# Altium project ANAlOG_MEZZANINE1.01.PrjPcb
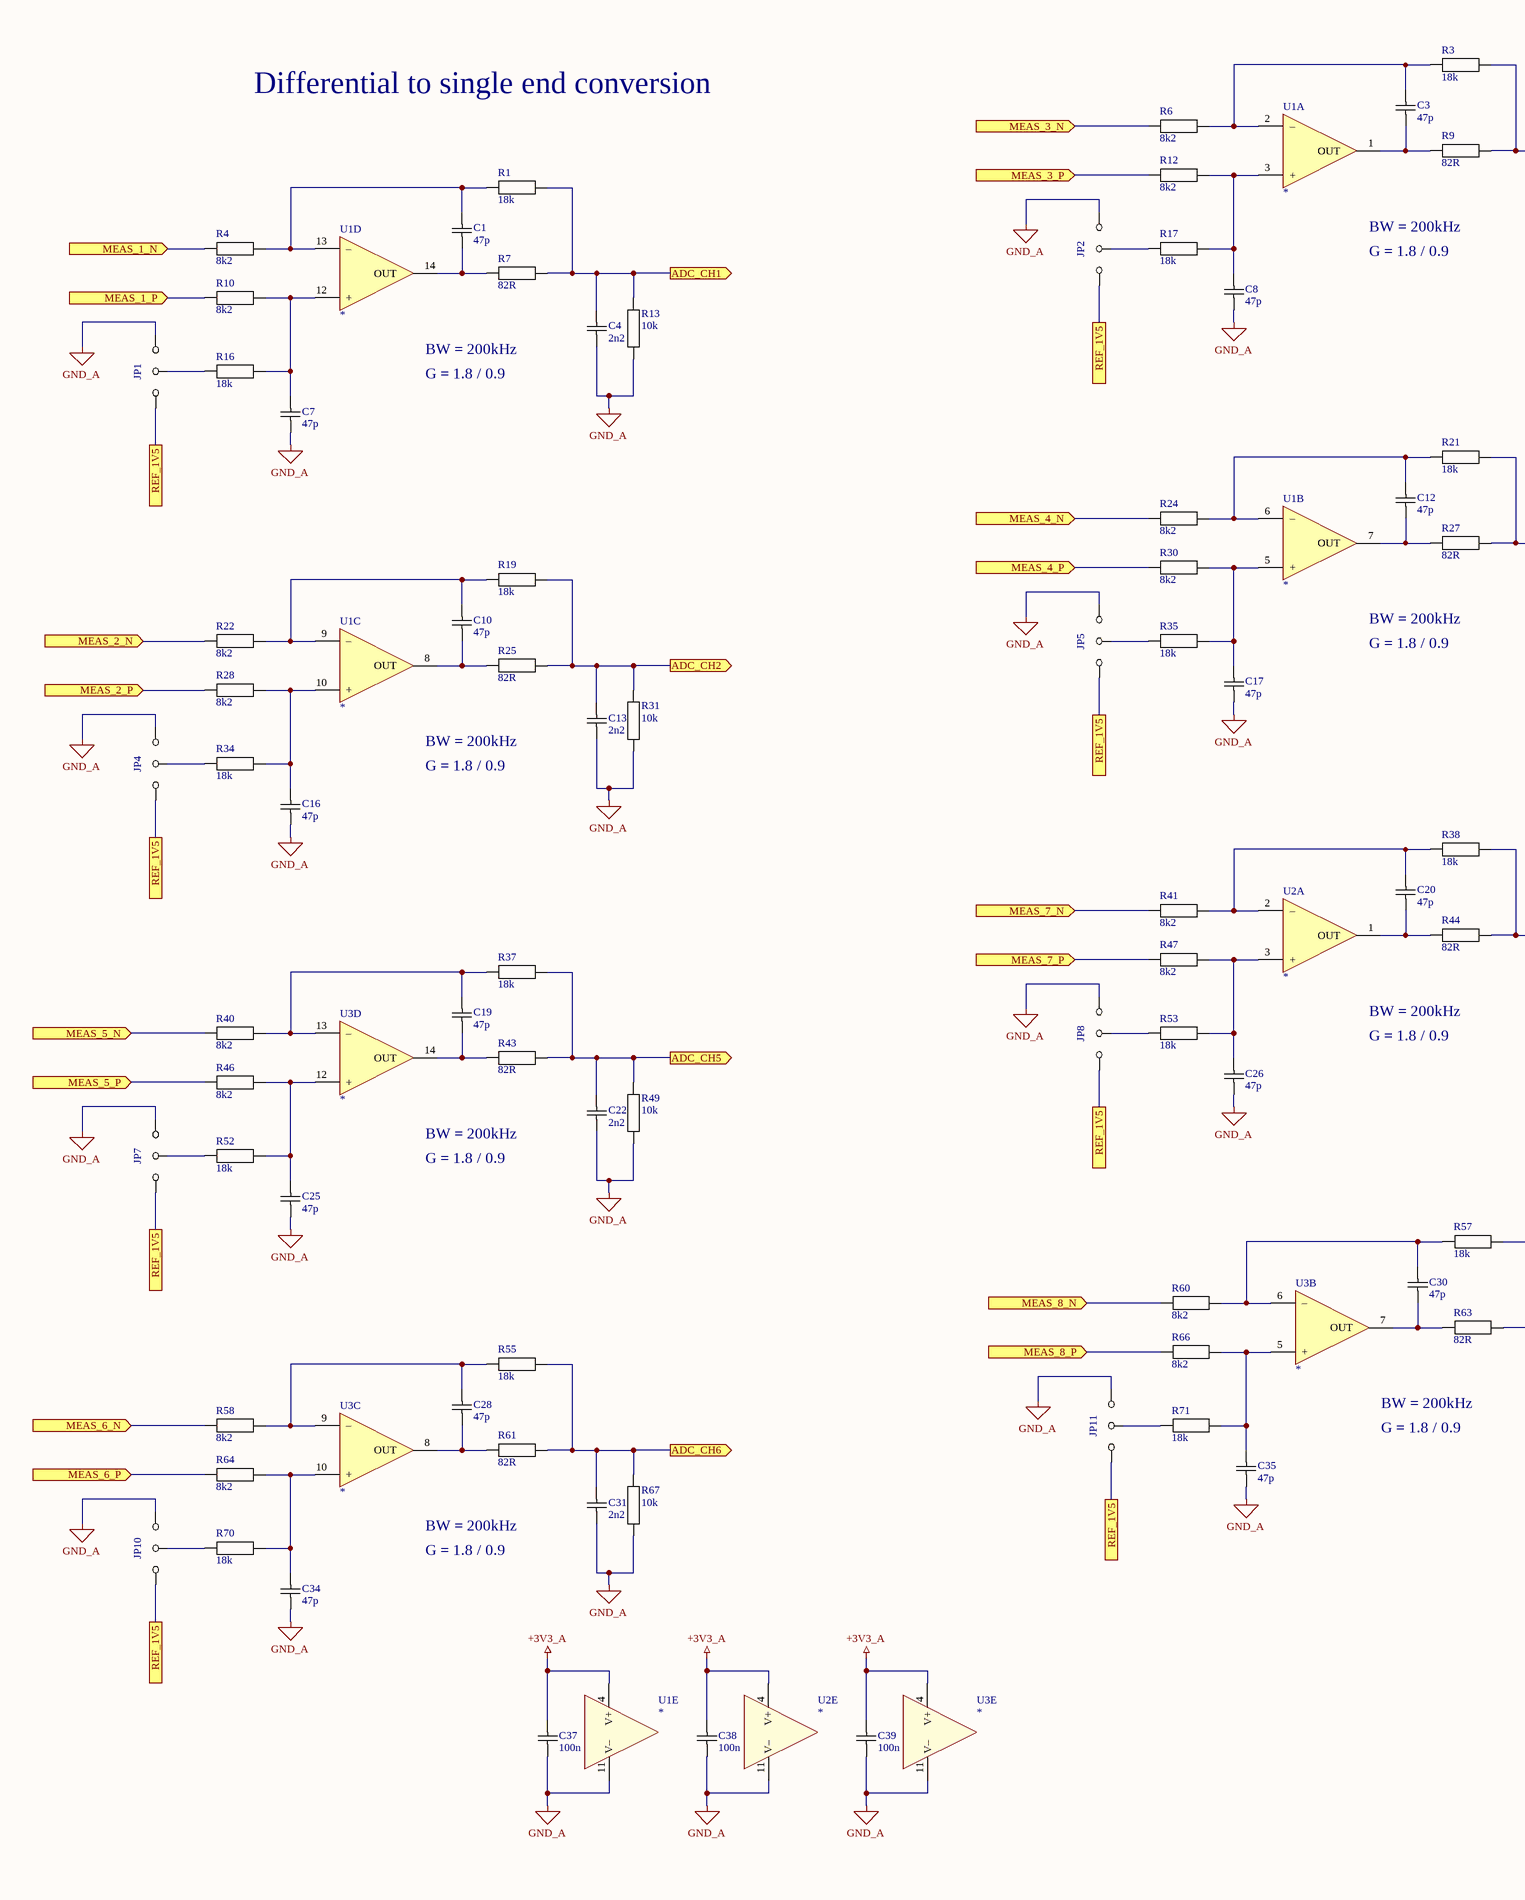
[diagram p0: AD_0_V1_01.SchDoc, left]
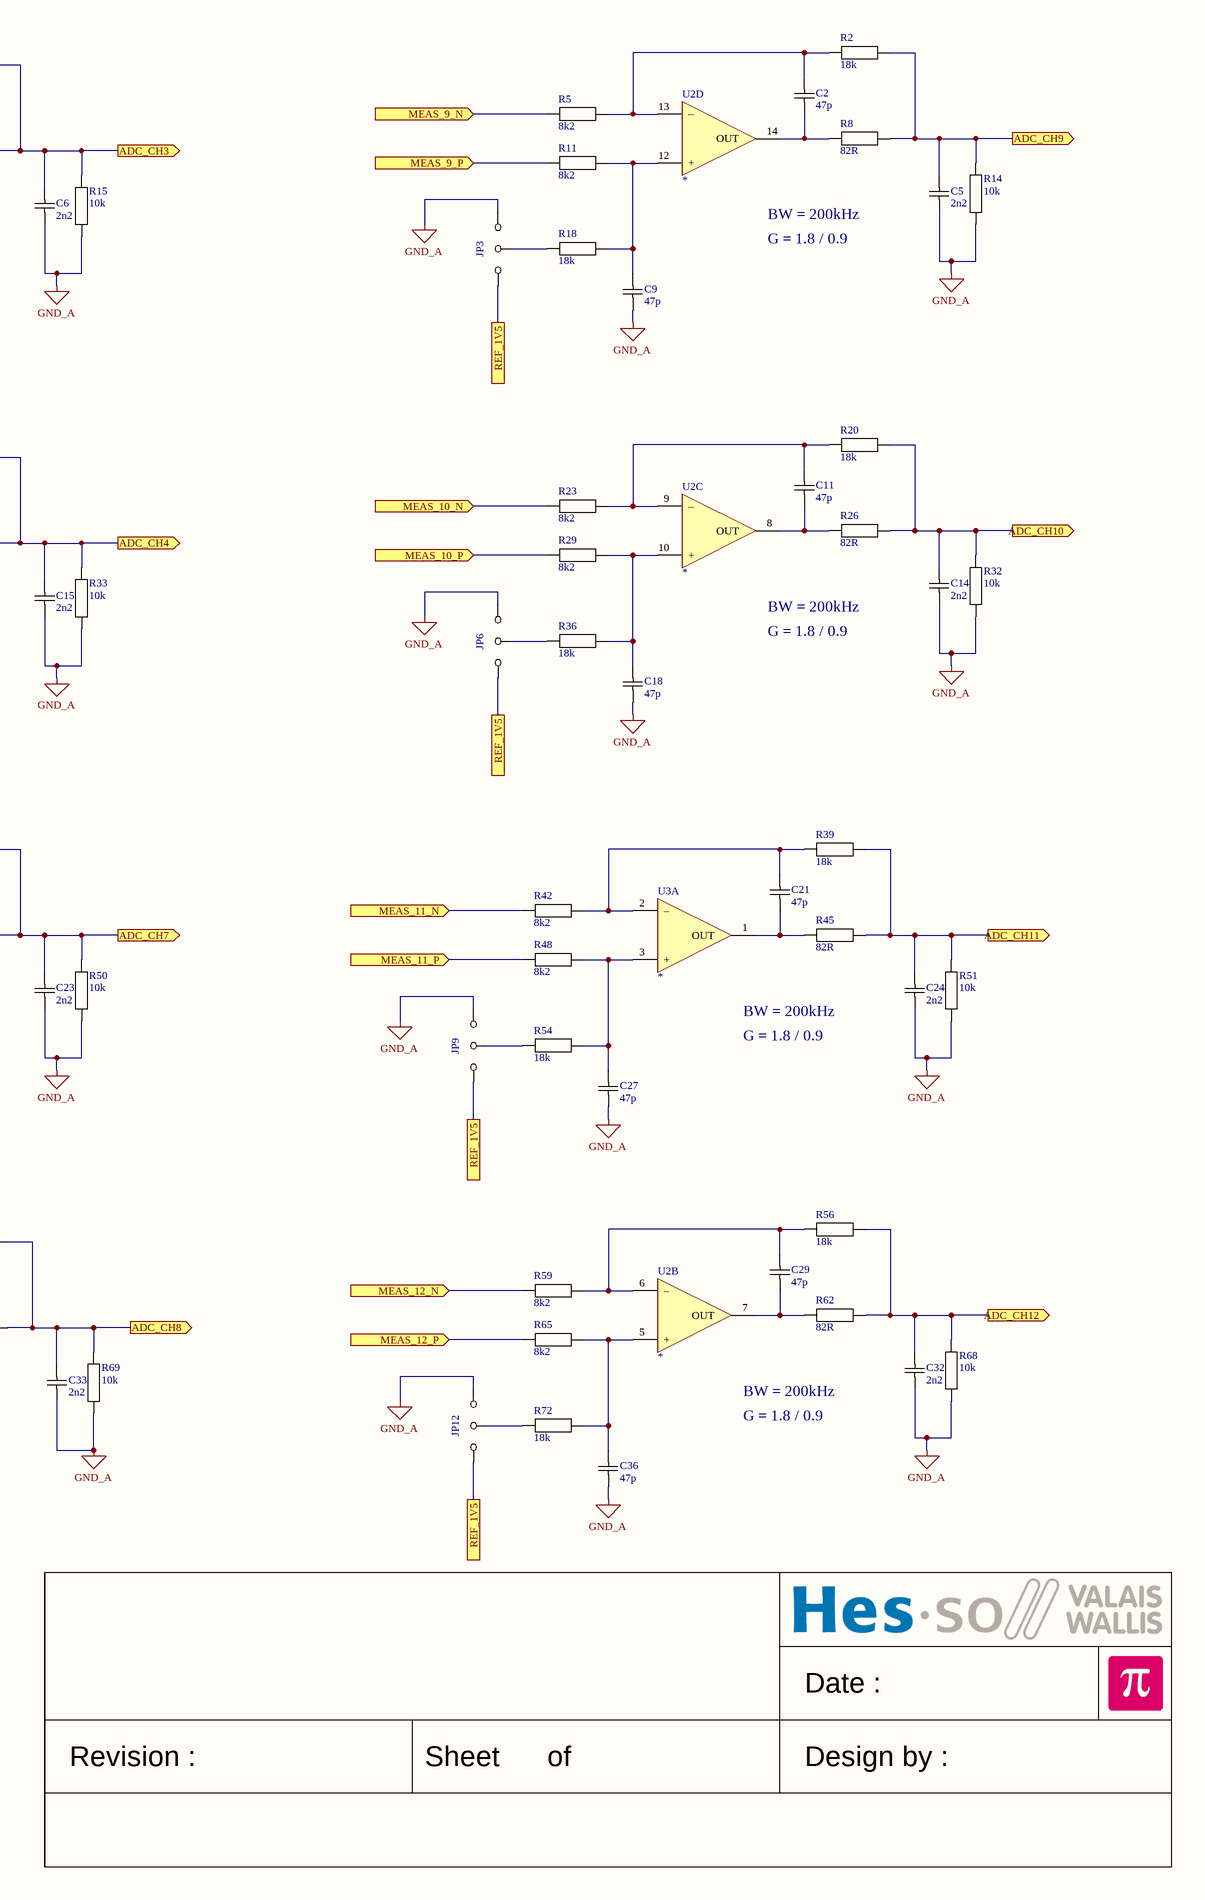
[diagram p1: AD_0_V1_01.SchDoc, right]
SchematicRevision: 1.0; SchematicDesigner: Jean Nanchen; SchematicDate: 09.06.2021; SchDate: 09.06.2021
4 sheets, 289 parts. Net scope: flat (ports and power ports of the same name join across sheets).
Board file: ANALOG_MezzanineV1_01.PcbDoc
Sheets:
  AD_0_V1_01.SchDoc
  AD_1_V1_01.SchDoc
  AD_3_V1_01.SchDoc
  Connector_0_V1_01.SchDoc

## Sheet AD_0_V1_01.SchDoc
size A2; Date: Date; CompanyName: HESSO; Engineer: Name; Address1: Route du Rawyl 47; Address2: 1950 Sion; Address3: Switzerland; DocumentNumber: 1; SheetNumber: 1; SheetTotal: 6; <: Nanchen Jean; ProjectName: Project Name

### Parts
C1  47p  [CAPACITOR 1608 REFLOW]
C2  47p  [CAPACITOR 1608 REFLOW]
C3  47p  [CAPACITOR 1608 REFLOW]
C4  2n2  [CAPACITOR 1608 REFLOW]
C5  2n2  [CAPACITOR 1608 REFLOW]
C6  2n2  [CAPACITOR 1608 REFLOW]
C7  47p  [CAPACITOR 1608 REFLOW]
C8  47p  [CAPACITOR 1608 REFLOW]
C9  47p  [CAPACITOR 1608 REFLOW]
C10  47p  [CAPACITOR 1608 REFLOW]
C11  47p  [CAPACITOR 1608 REFLOW]
C12  47p  [CAPACITOR 1608 REFLOW]
C13  2n2  [CAPACITOR 1608 REFLOW]
C14  2n2  [CAPACITOR 1608 REFLOW]
C15  2n2  [CAPACITOR 1608 REFLOW]
C16  47p  [CAPACITOR 1608 REFLOW]
C17  47p  [CAPACITOR 1608 REFLOW]
C18  47p  [CAPACITOR 1608 REFLOW]
C19  47p  [CAPACITOR 1608 REFLOW]
C20  47p  [CAPACITOR 1608 REFLOW]
C21  47p  [CAPACITOR 1608 REFLOW]
C22  2n2  [CAPACITOR 1608 REFLOW]
C23  2n2  [CAPACITOR 1608 REFLOW]
C24  2n2  [CAPACITOR 1608 REFLOW]
C25  47p  [CAPACITOR 1608 REFLOW]
C26  47p  [CAPACITOR 1608 REFLOW]
C27  47p  [CAPACITOR 1608 REFLOW]
C28  47p  [CAPACITOR 1608 REFLOW]
C29  47p  [CAPACITOR 1608 REFLOW]
C30  47p  [CAPACITOR 1608 REFLOW]
C31  2n2  [CAPACITOR 1608 REFLOW]
C32  2n2  [CAPACITOR 1608 REFLOW]
C33  2n2  [CAPACITOR 1608 REFLOW]
C34  47p  [CAPACITOR 1608 REFLOW]
C35  47p  [CAPACITOR 1608 REFLOW]
C36  47p  [CAPACITOR 1608 REFLOW]
C37  100n  [CAPACITOR 1608 REFLOW]
C38  100n  [CAPACITOR 1608 REFLOW]
C39  100n  [CAPACITOR 1608 REFLOW]
JP1  {Value}  [JUMPER3 SMD 1608]  (value not drawn)
JP2  {Value}  [JUMPER3 SMD 1608]  (value not drawn)
JP3  {Value}  [JUMPER3 SMD 1608]  (value not drawn)
JP4  {Value}  [JUMPER3 SMD 1608]  (value not drawn)
JP5  {Value}  [JUMPER3 SMD 1608]  (value not drawn)
JP6  {Value}  [JUMPER3 SMD 1608]  (value not drawn)
JP7  {Value}  [JUMPER3 SMD 1608]  (value not drawn)
JP8  {Value}  [JUMPER3 SMD 1608]  (value not drawn)
JP9  {Value}  [JUMPER3 SMD 1608]  (value not drawn)
JP10  {Value}  [JUMPER3 SMD 1608]  (value not drawn)
JP11  {Value}  [JUMPER3 SMD 1608]  (value not drawn)
JP12  {Value}  [JUMPER3 SMD 1608]  (value not drawn)
R1  18k  [RESISTOR 1608 REFLOW]
R2  18k  [RESISTOR 1608 REFLOW]
R3  18k  [RESISTOR 1608 REFLOW]
R4  8k2  [RESISTOR 1608 REFLOW]
R5  8k2  [RESISTOR 1608 REFLOW]
R6  8k2  [RESISTOR 1608 REFLOW]
R7  82R  [RESISTOR 1608 REFLOW]
R8  82R  [RESISTOR 1608 REFLOW]
R9  82R  [RESISTOR 1608 REFLOW]
R10  8k2  [RESISTOR 1608 REFLOW]
R11  8k2  [RESISTOR 1608 REFLOW]
R12  8k2  [RESISTOR 1608 REFLOW]
R13  10k  [RESISTOR 1608 REFLOW]
R14  10k  [RESISTOR 1608 REFLOW]
R15  10k  [RESISTOR 1608 REFLOW]
R16  18k  [RESISTOR 1608 REFLOW]
R17  18k  [RESISTOR 1608 REFLOW]
R18  18k  [RESISTOR 1608 REFLOW]
R19  18k  [RESISTOR 1608 REFLOW]
R20  18k  [RESISTOR 1608 REFLOW]
R21  18k  [RESISTOR 1608 REFLOW]
R22  8k2  [RESISTOR 1608 REFLOW]
R23  8k2  [RESISTOR 1608 REFLOW]
R24  8k2  [RESISTOR 1608 REFLOW]
R25  82R  [RESISTOR 1608 REFLOW]
R26  82R  [RESISTOR 1608 REFLOW]
R27  82R  [RESISTOR 1608 REFLOW]
R28  8k2  [RESISTOR 1608 REFLOW]
R29  8k2  [RESISTOR 1608 REFLOW]
R30  8k2  [RESISTOR 1608 REFLOW]
R31  10k  [RESISTOR 1608 REFLOW]
R32  10k  [RESISTOR 1608 REFLOW]
R33  10k  [RESISTOR 1608 REFLOW]
R34  18k  [RESISTOR 1608 REFLOW]
R35  18k  [RESISTOR 1608 REFLOW]
R36  18k  [RESISTOR 1608 REFLOW]
R37  18k  [RESISTOR 1608 REFLOW]
R38  18k  [RESISTOR 1608 REFLOW]
R39  18k  [RESISTOR 1608 REFLOW]
R40  8k2  [RESISTOR 1608 REFLOW]
R41  8k2  [RESISTOR 1608 REFLOW]
R42  8k2  [RESISTOR 1608 REFLOW]
R43  82R  [RESISTOR 1608 REFLOW]
R44  82R  [RESISTOR 1608 REFLOW]
R45  82R  [RESISTOR 1608 REFLOW]
R46  8k2  [RESISTOR 1608 REFLOW]
R47  8k2  [RESISTOR 1608 REFLOW]
R48  8k2  [RESISTOR 1608 REFLOW]
R49  10k  [RESISTOR 1608 REFLOW]
R50  10k  [RESISTOR 1608 REFLOW]
R51  10k  [RESISTOR 1608 REFLOW]
R52  18k  [RESISTOR 1608 REFLOW]
R53  18k  [RESISTOR 1608 REFLOW]
R54  18k  [RESISTOR 1608 REFLOW]
R55  18k  [RESISTOR 1608 REFLOW]
R56  18k  [RESISTOR 1608 REFLOW]
R57  18k  [RESISTOR 1608 REFLOW]
R58  8k2  [RESISTOR 1608 REFLOW]
R59  8k2  [RESISTOR 1608 REFLOW]
R60  8k2  [RESISTOR 1608 REFLOW]
R61  82R  [RESISTOR 1608 REFLOW]
R62  82R  [RESISTOR 1608 REFLOW]
R63  82R  [RESISTOR 1608 REFLOW]
R64  8k2  [RESISTOR 1608 REFLOW]
R65  8k2  [RESISTOR 1608 REFLOW]
R66  8k2  [RESISTOR 1608 REFLOW]
R67  10k  [RESISTOR 1608 REFLOW]
R68  10k  [RESISTOR 1608 REFLOW]
R69  10k  [RESISTOR 1608 REFLOW]
R70  18k  [RESISTOR 1608 REFLOW]
R71  18k  [RESISTOR 1608 REFLOW]
R72  18k  [RESISTOR 1608 REFLOW]
U1  *  [SO14 P1.27 C4.0X8.8 H1.75]  (parts A,B,C,D,E of 5)
U2  *  [SO14 P1.27 C4.0X8.8 H1.75]  (parts A,B,C,D,E of 5)
U3  *  [SO14 P1.27 C4.0X8.8 H1.75]  (parts A,B,C,D,E of 5)

### Ports
ADC_CH1 (out), ADC_CH2 (out), ADC_CH3 (out), ADC_CH4 (out), ADC_CH5 (out), ADC_CH6 (out), ADC_CH7 (out), ADC_CH8 (out), ADC_CH9 (out), ADC_CH10 (out), ADC_CH11 (out), ADC_CH12 (out), MEAS_1_N (in), MEAS_1_P (in), MEAS_2_N (in), MEAS_2_P (in), MEAS_3_N (in), MEAS_3_P (in), MEAS_4_N (in), MEAS_4_P (in), MEAS_5_N (in), MEAS_5_P (in), MEAS_6_N (in), MEAS_6_P (in), MEAS_7_N (in), MEAS_7_P (in), MEAS_8_N (in), MEAS_8_P (in), MEAS_9_N (in), MEAS_9_P (in), MEAS_10_N (in), MEAS_10_P (in), MEAS_11_N (in), MEAS_11_P (in), MEAS_12_N (in), MEAS_12_P (in), REF_1V5

### Nets
+3V3_A: C37.2 C38.2 C39.2 U1.4(V+) U2.4(V+) U3.4(V+)
GND_A: C4.1 C5.1 C6.1 C7.1 C8.1 C9.1 C13.1 C14.1 C15.1 C16.1 C17.1 C18.1 C22.1 C23.1 C24.1 C25.1 C26.1 C27.1 C31.1 C32.1 C33.1 C34.1 C35.1 C36.1 C37.1 C38.1 C39.1 JP1.3 JP2.3 JP3.3 JP4.3 JP5.3 JP6.3 JP7.3 JP8.3 JP9.3 JP10.3 JP11.3 JP12.3 R13.2 R14.2 R15.2 R31.2 R32.2 R33.2 R49.2 R50.2 R51.2 R67.2 R68.2 R69.2 U1.11(V–) U2.11(V–) U3.11(V–)
ADC_CH1: C4.2 R1.2 R7.2 R13.1 ; port ADC_CH1
ADC_CH2: C13.2 R19.2 R25.2 R31.1 ; port ADC_CH2
ADC_CH3: C6.2 R3.2 R9.2 R15.1 ; port ADC_CH3
ADC_CH4: C15.2 R21.2 R27.2 R33.1 ; port ADC_CH4
ADC_CH5: C22.2 R37.2 R43.2 R49.1 ; port ADC_CH5
ADC_CH6: C31.2 R55.2 R61.2 R67.1 ; port ADC_CH6
ADC_CH7: C23.2 R38.2 R44.2 R50.1 ; port ADC_CH7
ADC_CH8: C33.2 R57.2 R63.2 R69.1 ; port ADC_CH8
ADC_CH9: C5.2 R2.2 R8.2 R14.1 ; port ADC_CH9
ADC_CH10: C14.2 R20.2 R26.2 R32.1 ; port ADC_CH10
ADC_CH11: C24.2 R39.2 R45.2 R51.1 ; port ADC_CH11
ADC_CH12: C32.2 R56.2 R62.2 R68.1 ; port ADC_CH12
MEAS_1_N: R4.1 ; port MEAS_1_N
MEAS_1_P: R10.1 ; port MEAS_1_P
MEAS_2_N: R22.1 ; port MEAS_2_N
MEAS_2_P: R28.1 ; port MEAS_2_P
MEAS_3_N: R6.1 ; port MEAS_3_N
MEAS_3_P: R12.1 ; port MEAS_3_P
MEAS_4_N: R24.1 ; port MEAS_4_N
MEAS_4_P: R30.1 ; port MEAS_4_P
MEAS_5_N: R40.1 ; port MEAS_5_N
MEAS_5_P: R46.1 ; port MEAS_5_P
MEAS_6_N: R58.1 ; port MEAS_6_N
MEAS_6_P: R64.1 ; port MEAS_6_P
MEAS_7_N: R41.1 ; port MEAS_7_N
MEAS_7_P: R47.1 ; port MEAS_7_P
MEAS_8_N: R60.1 ; port MEAS_8_N
MEAS_8_P: R66.1 ; port MEAS_8_P
MEAS_9_N: R5.1 ; port MEAS_9_N
MEAS_9_P: R11.1 ; port MEAS_9_P
MEAS_10_N: R23.1 ; port MEAS_10_N
MEAS_10_P: R29.1 ; port MEAS_10_P
MEAS_11_N: R42.1 ; port MEAS_11_N
MEAS_11_P: R48.1 ; port MEAS_11_P
MEAS_12_N: R59.1 ; port MEAS_12_N
MEAS_12_P: R65.1 ; port MEAS_12_P
REF_1V5: JP1.1 JP2.1 JP3.1 JP4.1 JP5.1 JP6.1 JP7.1 JP8.1 JP9.1 JP10.1 JP11.1 JP12.1 ; port REF_1V5
NetC1_1: C1.1 R7.1 U1.14(OUT)
NetC1_2: C1.2 R1.1 R4.2 U1.13(–)
NetC2_1: C2.1 R8.1 U2.14(OUT)
NetC2_2: C2.2 R2.1 R5.2 U2.13(–)
NetC3_1: C3.1 R9.1 U1.1(OUT)
NetC3_2: C3.2 R3.1 R6.2 U1.2(–)
NetC7_2: C7.2 R10.2 R16.1 U1.12(+)
NetC8_2: C8.2 R12.2 R17.1 U1.3(+)
NetC9_2: C9.2 R11.2 R18.1 U2.12(+)
NetC10_1: C10.1 R25.1 U1.8(OUT)
NetC10_2: C10.2 R19.1 R22.2 U1.9(–)
NetC11_1: C11.1 R26.1 U2.8(OUT)
NetC11_2: C11.2 R20.1 R23.2 U2.9(–)
NetC12_1: C12.1 R27.1 U1.7(OUT)
NetC12_2: C12.2 R21.1 R24.2 U1.6(–)
NetC16_2: C16.2 R28.2 R34.1 U1.10(+)
NetC17_2: C17.2 R30.2 R35.1 U1.5(+)
NetC18_2: C18.2 R29.2 R36.1 U2.10(+)
NetC19_1: C19.1 R43.1 U3.14(OUT)
NetC19_2: C19.2 R37.1 R40.2 U3.13(–)
NetC20_1: C20.1 R44.1 U2.1(OUT)
NetC20_2: C20.2 R38.1 R41.2 U2.2(–)
NetC21_1: C21.1 R45.1 U3.1(OUT)
NetC21_2: C21.2 R39.1 R42.2 U3.2(–)
NetC25_2: C25.2 R46.2 R52.1 U3.12(+)
NetC26_2: C26.2 R47.2 R53.1 U2.3(+)
NetC27_2: C27.2 R48.2 R54.1 U3.3(+)
NetC28_1: C28.1 R61.1 U3.8(OUT)
NetC28_2: C28.2 R55.1 R58.2 U3.9(–)
NetC29_1: C29.1 R62.1 U2.7(OUT)
NetC29_2: C29.2 R56.1 R59.2 U2.6(–)
NetC30_1: C30.1 R63.1 U3.7(OUT)
NetC30_2: C30.2 R57.1 R60.2 U3.6(–)
NetC34_2: C34.2 R64.2 R70.1 U3.10(+)
NetC35_2: C35.2 R66.2 R71.1 U3.5(+)
NetC36_2: C36.2 R65.2 R72.1 U2.5(+)
NetJP1_2: JP1.2 R16.2
NetJP2_2: JP2.2 R17.2
NetJP3_2: JP3.2 R18.2
NetJP4_2: JP4.2 R34.2
NetJP5_2: JP5.2 R35.2
NetJP6_2: JP6.2 R36.2
NetJP7_2: JP7.2 R52.2
NetJP8_2: JP8.2 R53.2
NetJP9_2: JP9.2 R54.2
NetJP10_2: JP10.2 R70.2
NetJP11_2: JP11.2 R71.2
NetJP12_2: JP12.2 R72.2

### Notes on the sheet
- Differential to single end conversion
- BW = 200kHz
- G = 1.8 / 0.9
- Date :
- Revision :
- Sheet
- of
- Design by :

### Library data of the parts
C1-C39 = Capacitor: Capacitor X7R 10% 50V 1608(0603)
  C1-C3 C7-C12 C16-C21 C25-C30 C34-C36: Value: 47p
  C4-C6 C13-C15 C22-C24 C31-C33: Value: 2n2
  C37-C39: Value: 100n
JP1-JP12 = JUMPER 3 POS: Value: {Value}
R1-R72 = Resistor: Resistor 1% 50V 100mW 1608(0603)
  R1-R3 R16-R21 R34-R39 R52-R57 R70-R72: Value: 18k
  R4-R6 R10-R12 R22-R24 R28-R30 R40-R42 R46-R48 R58-R60 R64-R66: Value: 8k2
  R7-R9 R25-R27 R43-R45 R61-R63: Value: 82R
  R13-R15 R31-R33 R49-R51 R67-R69: Value: 10k
U1-U3 = OPA QUAD: Generic quad OPA 14 pins; Value: *

## Sheet AD_1_V1_01.SchDoc
size A2; Date: Date; CompanyName: HESSO; Engineer: Name; Address1: Route du Rawyl 47; Address2: 1950 Sion; Address3: Switzerland; DocumentNumber: 2; SheetNumber: 2; SheetTotal: 6; ProjectName: Project Name
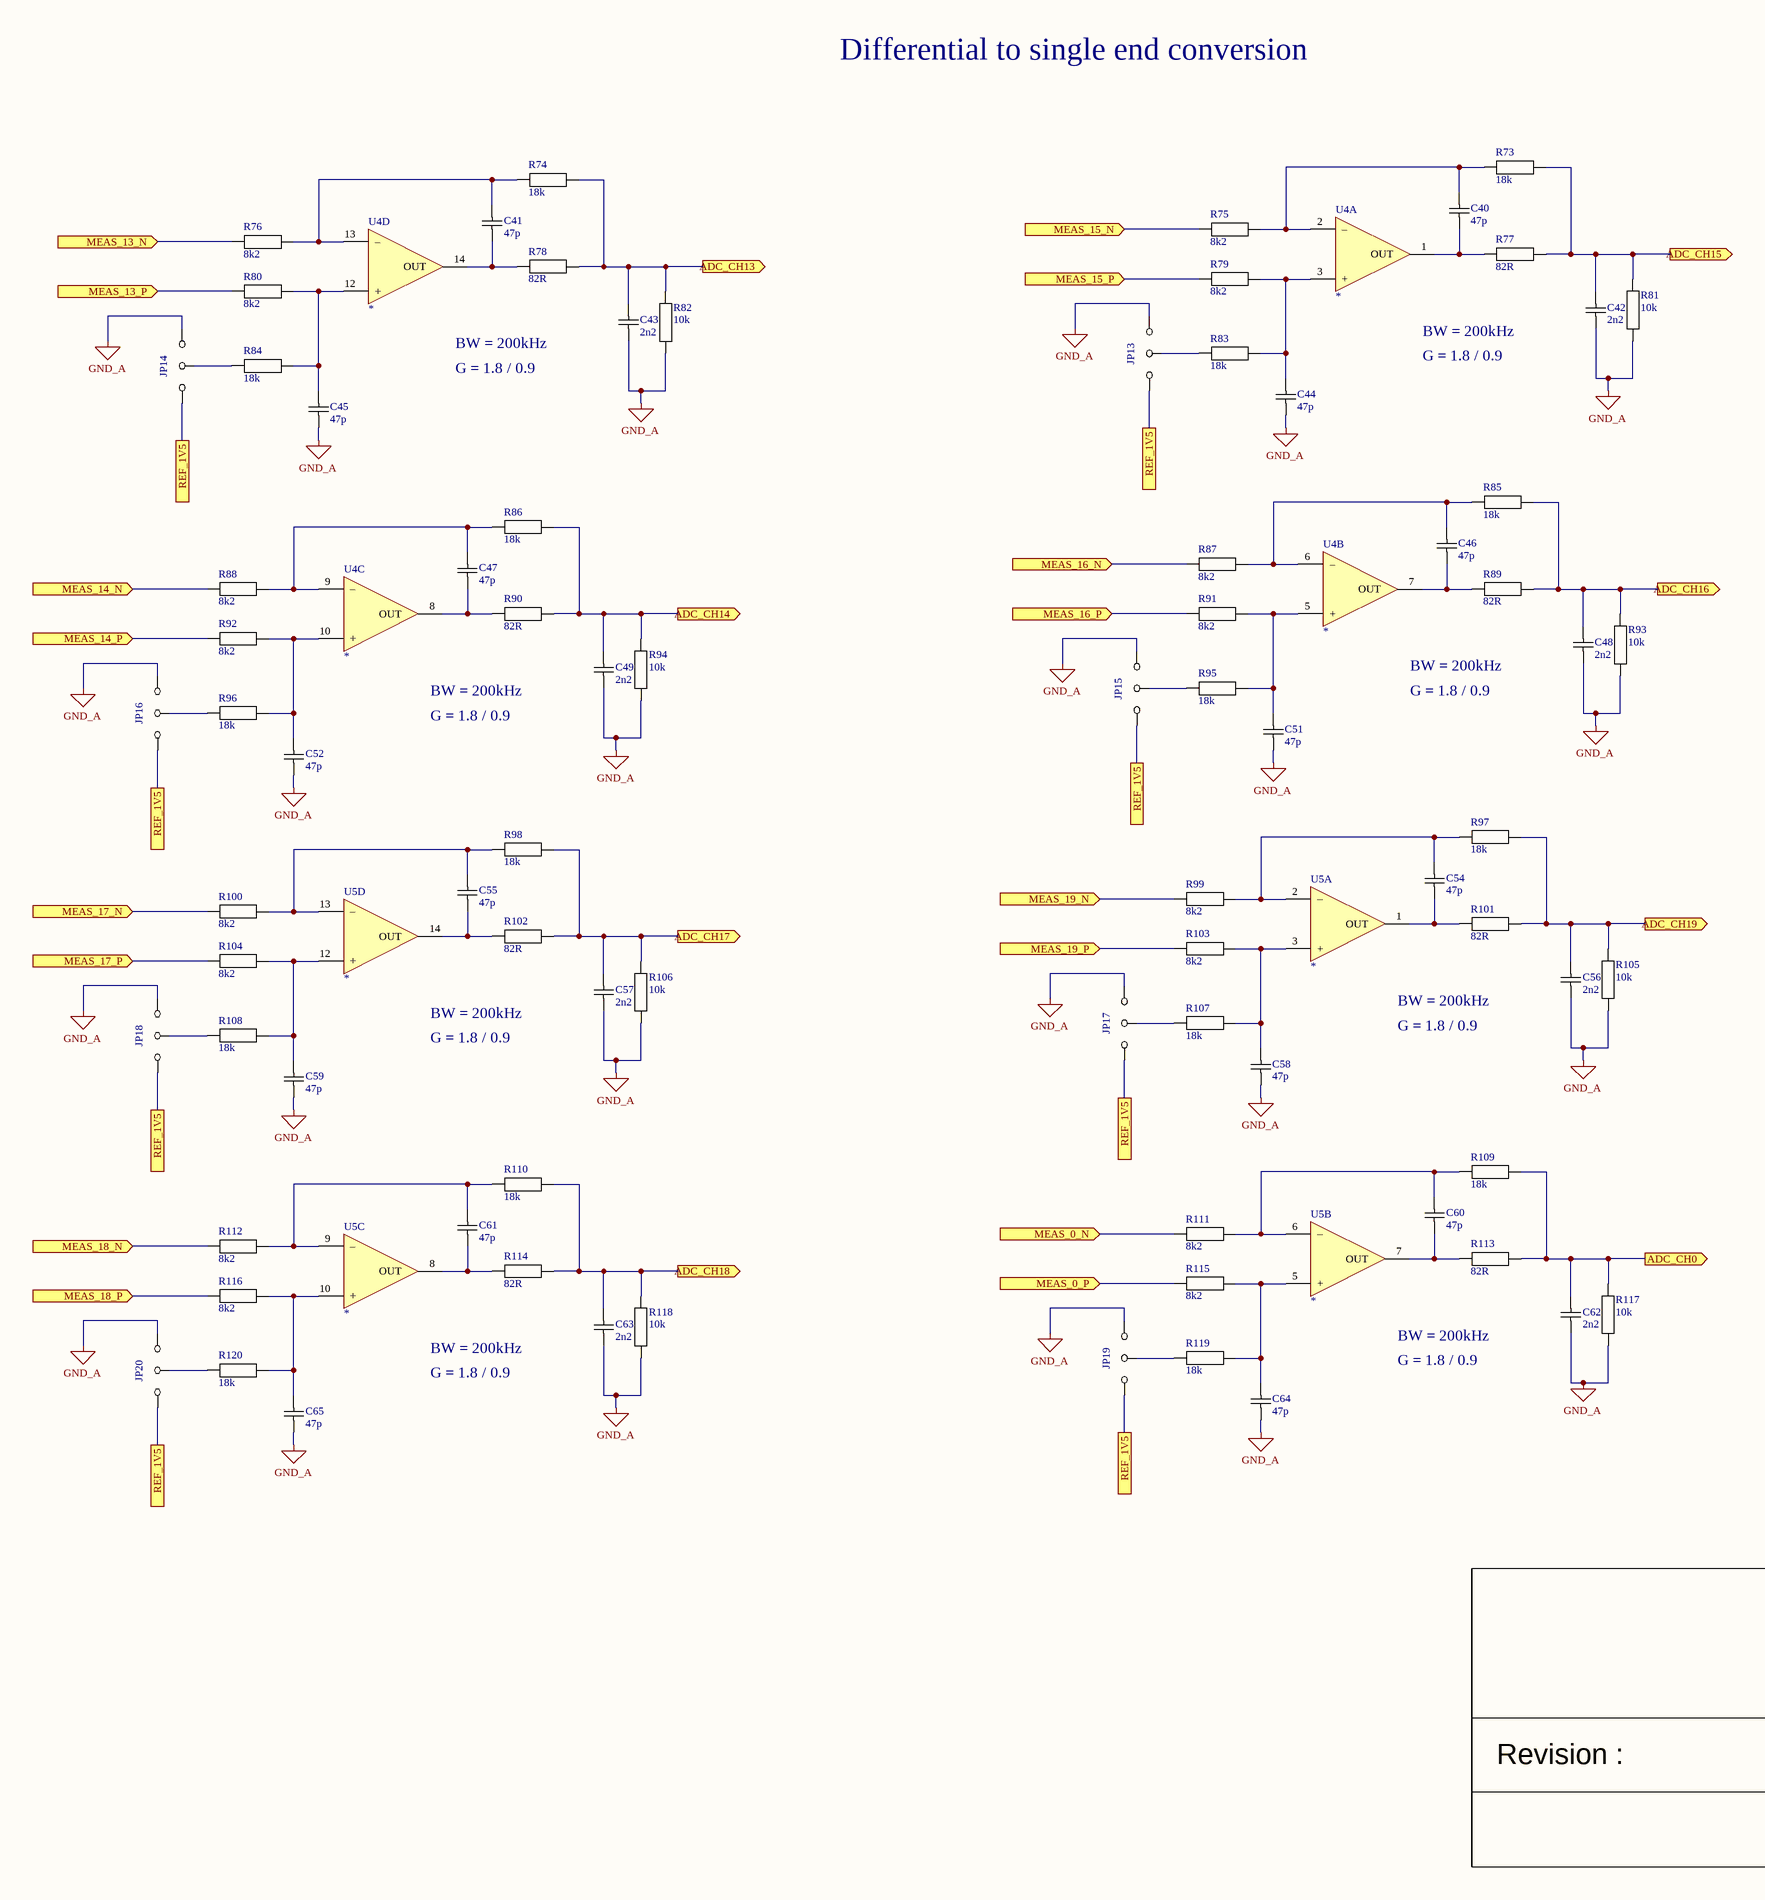
[diagram p2: AD_1_V1_01.SchDoc, left]
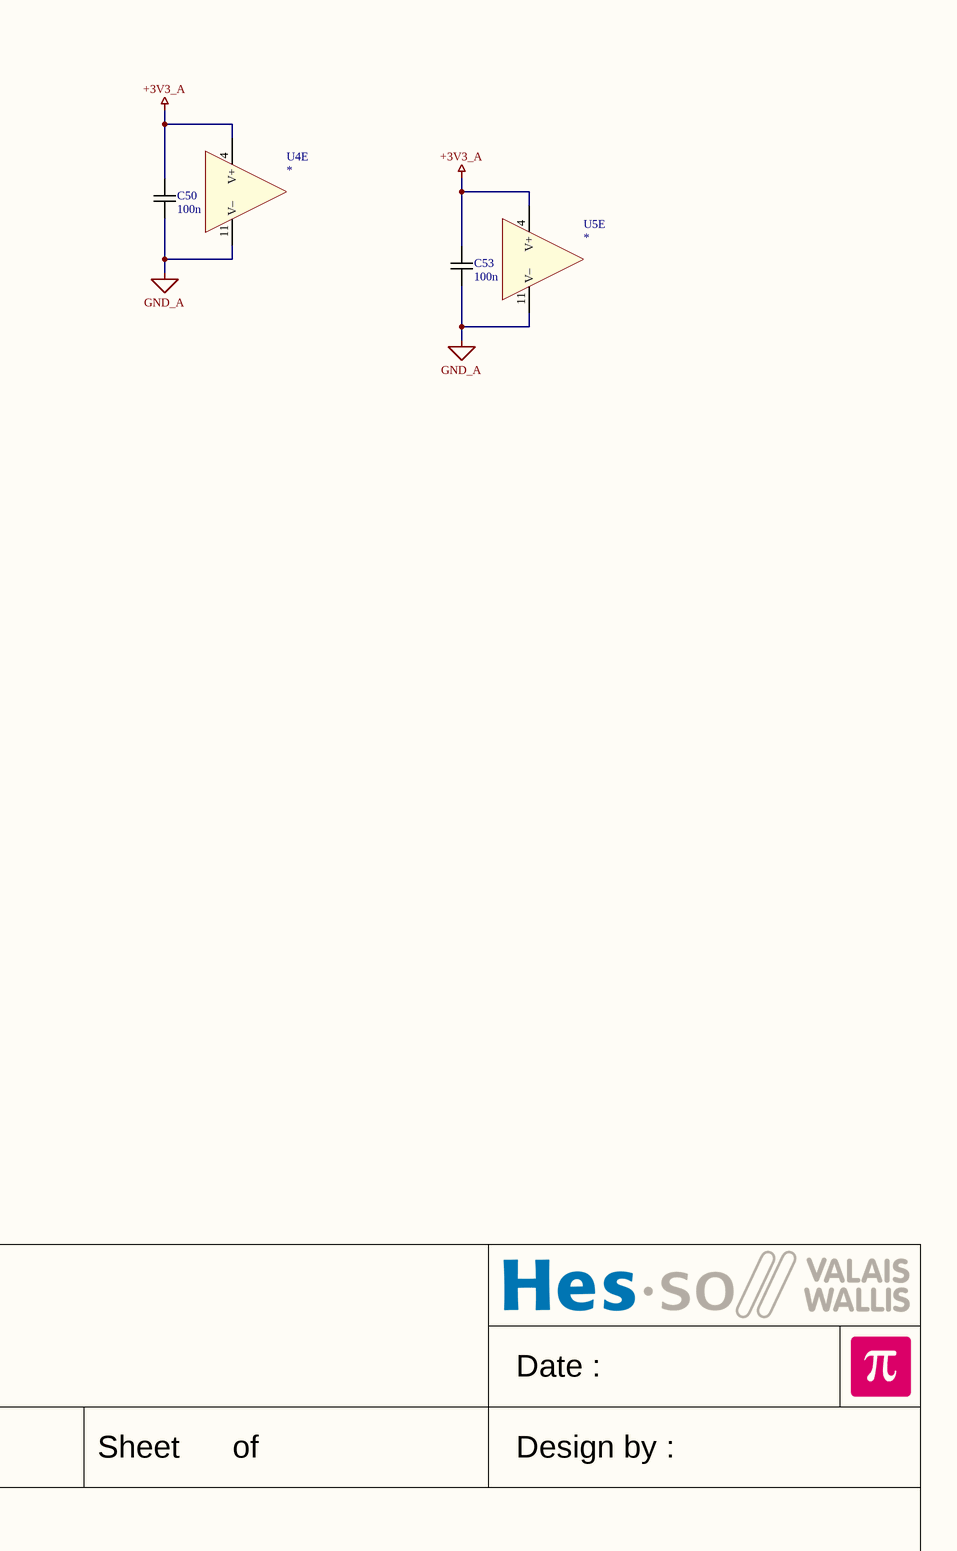
[diagram p3: AD_1_V1_01.SchDoc, right]

### Parts
C40  47p  [CAPACITOR 1608 REFLOW]
C41  47p  [CAPACITOR 1608 REFLOW]
C42  2n2  [CAPACITOR 1608 REFLOW]
C43  2n2  [CAPACITOR 1608 REFLOW]
C44  47p  [CAPACITOR 1608 REFLOW]
C45  47p  [CAPACITOR 1608 REFLOW]
C46  47p  [CAPACITOR 1608 REFLOW]
C47  47p  [CAPACITOR 1608 REFLOW]
C48  2n2  [CAPACITOR 1608 REFLOW]
C49  2n2  [CAPACITOR 1608 REFLOW]
C50  100n  [CAPACITOR 1608 REFLOW]
C51  47p  [CAPACITOR 1608 REFLOW]
C52  47p  [CAPACITOR 1608 REFLOW]
C53  100n  [CAPACITOR 1608 REFLOW]
C54  47p  [CAPACITOR 1608 REFLOW]
C55  47p  [CAPACITOR 1608 REFLOW]
C56  2n2  [CAPACITOR 1608 REFLOW]
C57  2n2  [CAPACITOR 1608 REFLOW]
C58  47p  [CAPACITOR 1608 REFLOW]
C59  47p  [CAPACITOR 1608 REFLOW]
C60  47p  [CAPACITOR 1608 REFLOW]
C61  47p  [CAPACITOR 1608 REFLOW]
C62  2n2  [CAPACITOR 1608 REFLOW]
C63  2n2  [CAPACITOR 1608 REFLOW]
C64  47p  [CAPACITOR 1608 REFLOW]
C65  47p  [CAPACITOR 1608 REFLOW]
JP13  {Value}  [JUMPER3 SMD 1608]  (value not drawn)
JP14  {Value}  [JUMPER3 SMD 1608]  (value not drawn)
JP15  {Value}  [JUMPER3 SMD 1608]  (value not drawn)
JP16  {Value}  [JUMPER3 SMD 1608]  (value not drawn)
JP17  {Value}  [JUMPER3 SMD 1608]  (value not drawn)
JP18  {Value}  [JUMPER3 SMD 1608]  (value not drawn)
JP19  {Value}  [JUMPER3 SMD 1608]  (value not drawn)
JP20  {Value}  [JUMPER3 SMD 1608]  (value not drawn)
R73  18k  [RESISTOR 1608 REFLOW]
R74  18k  [RESISTOR 1608 REFLOW]
R75  8k2  [RESISTOR 1608 REFLOW]
R76  8k2  [RESISTOR 1608 REFLOW]
R77  82R  [RESISTOR 1608 REFLOW]
R78  82R  [RESISTOR 1608 REFLOW]
R79  8k2  [RESISTOR 1608 REFLOW]
R80  8k2  [RESISTOR 1608 REFLOW]
R81  10k  [RESISTOR 1608 REFLOW]
R82  10k  [RESISTOR 1608 REFLOW]
R83  18k  [RESISTOR 1608 REFLOW]
R84  18k  [RESISTOR 1608 REFLOW]
R85  18k  [RESISTOR 1608 REFLOW]
R86  18k  [RESISTOR 1608 REFLOW]
R87  8k2  [RESISTOR 1608 REFLOW]
R88  8k2  [RESISTOR 1608 REFLOW]
R89  82R  [RESISTOR 1608 REFLOW]
R90  82R  [RESISTOR 1608 REFLOW]
R91  8k2  [RESISTOR 1608 REFLOW]
R92  8k2  [RESISTOR 1608 REFLOW]
R93  10k  [RESISTOR 1608 REFLOW]
R94  10k  [RESISTOR 1608 REFLOW]
R95  18k  [RESISTOR 1608 REFLOW]
R96  18k  [RESISTOR 1608 REFLOW]
R97  18k  [RESISTOR 1608 REFLOW]
R98  18k  [RESISTOR 1608 REFLOW]
R99  8k2  [RESISTOR 1608 REFLOW]
R100  8k2  [RESISTOR 1608 REFLOW]
R101  82R  [RESISTOR 1608 REFLOW]
R102  82R  [RESISTOR 1608 REFLOW]
R103  8k2  [RESISTOR 1608 REFLOW]
R104  8k2  [RESISTOR 1608 REFLOW]
R105  10k  [RESISTOR 1608 REFLOW]
R106  10k  [RESISTOR 1608 REFLOW]
R107  18k  [RESISTOR 1608 REFLOW]
R108  18k  [RESISTOR 1608 REFLOW]
R109  18k  [RESISTOR 1608 REFLOW]
R110  18k  [RESISTOR 1608 REFLOW]
R111  8k2  [RESISTOR 1608 REFLOW]
R112  8k2  [RESISTOR 1608 REFLOW]
R113  82R  [RESISTOR 1608 REFLOW]
R114  82R  [RESISTOR 1608 REFLOW]
R115  8k2  [RESISTOR 1608 REFLOW]
R116  8k2  [RESISTOR 1608 REFLOW]
R117  10k  [RESISTOR 1608 REFLOW]
R118  10k  [RESISTOR 1608 REFLOW]
R119  18k  [RESISTOR 1608 REFLOW]
R120  18k  [RESISTOR 1608 REFLOW]
U4  *  [SO14 P1.27 C4.0X8.8 H1.75]  (parts A,B,C,D,E of 5)
U5  *  [SO14 P1.27 C4.0X8.8 H1.75]  (parts A,B,C,D,E of 5)

### Ports
ADC_CH0 (out), ADC_CH13 (out), ADC_CH14 (out), ADC_CH15 (out), ADC_CH16 (out), ADC_CH17 (out), ADC_CH18 (out), ADC_CH19 (out), MEAS_0_N (in), MEAS_0_P (in), MEAS_13_N (in), MEAS_13_P (in), MEAS_14_N (in), MEAS_14_P (in), MEAS_15_N (in), MEAS_15_P (in), MEAS_16_N (in), MEAS_16_P (in), MEAS_17_N (in), MEAS_17_P (in), MEAS_18_N (in), MEAS_18_P (in), MEAS_19_N (in), MEAS_19_P (in), REF_1V5

### Nets
+3V3_A: C50.2 C53.2 U4.4(V+) U5.4(V+)
GND_A: C42.1 C43.1 C44.1 C45.1 C48.1 C49.1 C50.1 C51.1 C52.1 C53.1 C56.1 C57.1 C58.1 C59.1 C62.1 C63.1 C64.1 C65.1 JP13.3 JP14.3 JP15.3 JP16.3 JP17.3 JP18.3 JP19.3 JP20.3 R81.2 R82.2 R93.2 R94.2 R105.2 R106.2 R117.2 R118.2 U4.11(V–) U5.11(V–)
ADC_CH0: C62.2 R109.2 R113.2 R117.1 ; port ADC_CH0
ADC_CH13: C43.2 R74.2 R78.2 R82.1 ; port ADC_CH13
ADC_CH14: C49.2 R86.2 R90.2 R94.1 ; port ADC_CH14
ADC_CH15: C42.2 R73.2 R77.2 R81.1 ; port ADC_CH15
ADC_CH16: C48.2 R85.2 R89.2 R93.1 ; port ADC_CH16
ADC_CH17: C57.2 R98.2 R102.2 R106.1 ; port ADC_CH17
ADC_CH18: C63.2 R110.2 R114.2 R118.1 ; port ADC_CH18
ADC_CH19: C56.2 R97.2 R101.2 R105.1 ; port ADC_CH19
MEAS_0_N: R111.1 ; port MEAS_0_N
MEAS_0_P: R115.1 ; port MEAS_0_P
MEAS_13_N: R76.1 ; port MEAS_13_N
MEAS_13_P: R80.1 ; port MEAS_13_P
MEAS_14_N: R88.1 ; port MEAS_14_N
MEAS_14_P: R92.1 ; port MEAS_14_P
MEAS_15_N: R75.1 ; port MEAS_15_N
MEAS_15_P: R79.1 ; port MEAS_15_P
MEAS_16_N: R87.1 ; port MEAS_16_N
MEAS_16_P: R91.1 ; port MEAS_16_P
MEAS_17_N: R100.1 ; port MEAS_17_N
MEAS_17_P: R104.1 ; port MEAS_17_P
MEAS_18_N: R112.1 ; port MEAS_18_N
MEAS_18_P: R116.1 ; port MEAS_18_P
MEAS_19_N: R99.1 ; port MEAS_19_N
MEAS_19_P: R103.1 ; port MEAS_19_P
REF_1V5: JP13.1 JP14.1 JP15.1 JP16.1 JP17.1 JP18.1 JP19.1 JP20.1 ; port REF_1V5
NetC40_1: C40.1 R77.1 U4.1(OUT)
NetC40_2: C40.2 R73.1 R75.2 U4.2(–)
NetC41_1: C41.1 R78.1 U4.14(OUT)
NetC41_2: C41.2 R74.1 R76.2 U4.13(–)
NetC44_2: C44.2 R79.2 R83.1 U4.3(+)
NetC45_2: C45.2 R80.2 R84.1 U4.12(+)
NetC46_1: C46.1 R89.1 U4.7(OUT)
NetC46_2: C46.2 R85.1 R87.2 U4.6(–)
NetC47_1: C47.1 R90.1 U4.8(OUT)
NetC47_2: C47.2 R86.1 R88.2 U4.9(–)
NetC51_2: C51.2 R91.2 R95.1 U4.5(+)
NetC52_2: C52.2 R92.2 R96.1 U4.10(+)
NetC54_1: C54.1 R101.1 U5.1(OUT)
NetC54_2: C54.2 R97.1 R99.2 U5.2(–)
NetC55_1: C55.1 R102.1 U5.14(OUT)
NetC55_2: C55.2 R98.1 R100.2 U5.13(–)
NetC58_2: C58.2 R103.2 R107.1 U5.3(+)
NetC59_2: C59.2 R104.2 R108.1 U5.12(+)
NetC60_1: C60.1 R113.1 U5.7(OUT)
NetC60_2: C60.2 R109.1 R111.2 U5.6(–)
NetC61_1: C61.1 R114.1 U5.8(OUT)
NetC61_2: C61.2 R110.1 R112.2 U5.9(–)
NetC64_2: C64.2 R115.2 R119.1 U5.5(+)
NetC65_2: C65.2 R116.2 R120.1 U5.10(+)
NetJP13_2: JP13.2 R83.2
NetJP14_2: JP14.2 R84.2
NetJP15_2: JP15.2 R95.2
NetJP16_2: JP16.2 R96.2
NetJP17_2: JP17.2 R107.2
NetJP18_2: JP18.2 R108.2
NetJP19_2: JP19.2 R119.2
NetJP20_2: JP20.2 R120.2

### Notes on the sheet
- Differential to single end conversion
- BW = 200kHz
- G = 1.8 / 0.9
- Date :
- Revision :
- Sheet
- of
- Design by :

### Library data of the parts
C40-C65 = Capacitor: Capacitor X7R 10% 50V 1608(0603)
  C40 C41 C44-C47 C51 C52 C54 C55 C58-C61 C64 C65: Value: 47p
  C42 C43 C48 C49 C56 C57 C62 C63: Value: 2n2
  C50 C53: Value: 100n
JP13-JP20 = JUMPER 3 POS: Value: {Value}
R73-R120 = Resistor: Resistor 1% 50V 100mW 1608(0603)
  R73 R74 R83-R86 R95-R98 R107-R110 R119 R120: Value: 18k
  R75 R76 R79 R80 R87 R88 R91 R92 R99 R100 R103 R104 R111 R112 R115 R116: Value: 8k2
  R77 R78 R89 R90 R101 R102 R113 R114: Value: 82R
  R81 R82 R93 R94 R105 R106 R117 R118: Value: 10k
U4 U5 = OPA QUAD: Generic quad OPA 14 pins; Value: *

## Sheet AD_3_V1_01.SchDoc
size A2; Date: Date; CompanyName: HESSO; Engineer: Name; Address1: Route du Rawyl 47; Address2: 1950 Sion; Address3: Switzerland; DocumentNumber: 3; SheetNumber: 3; SheetTotal: 6; ProjectName: Project Name
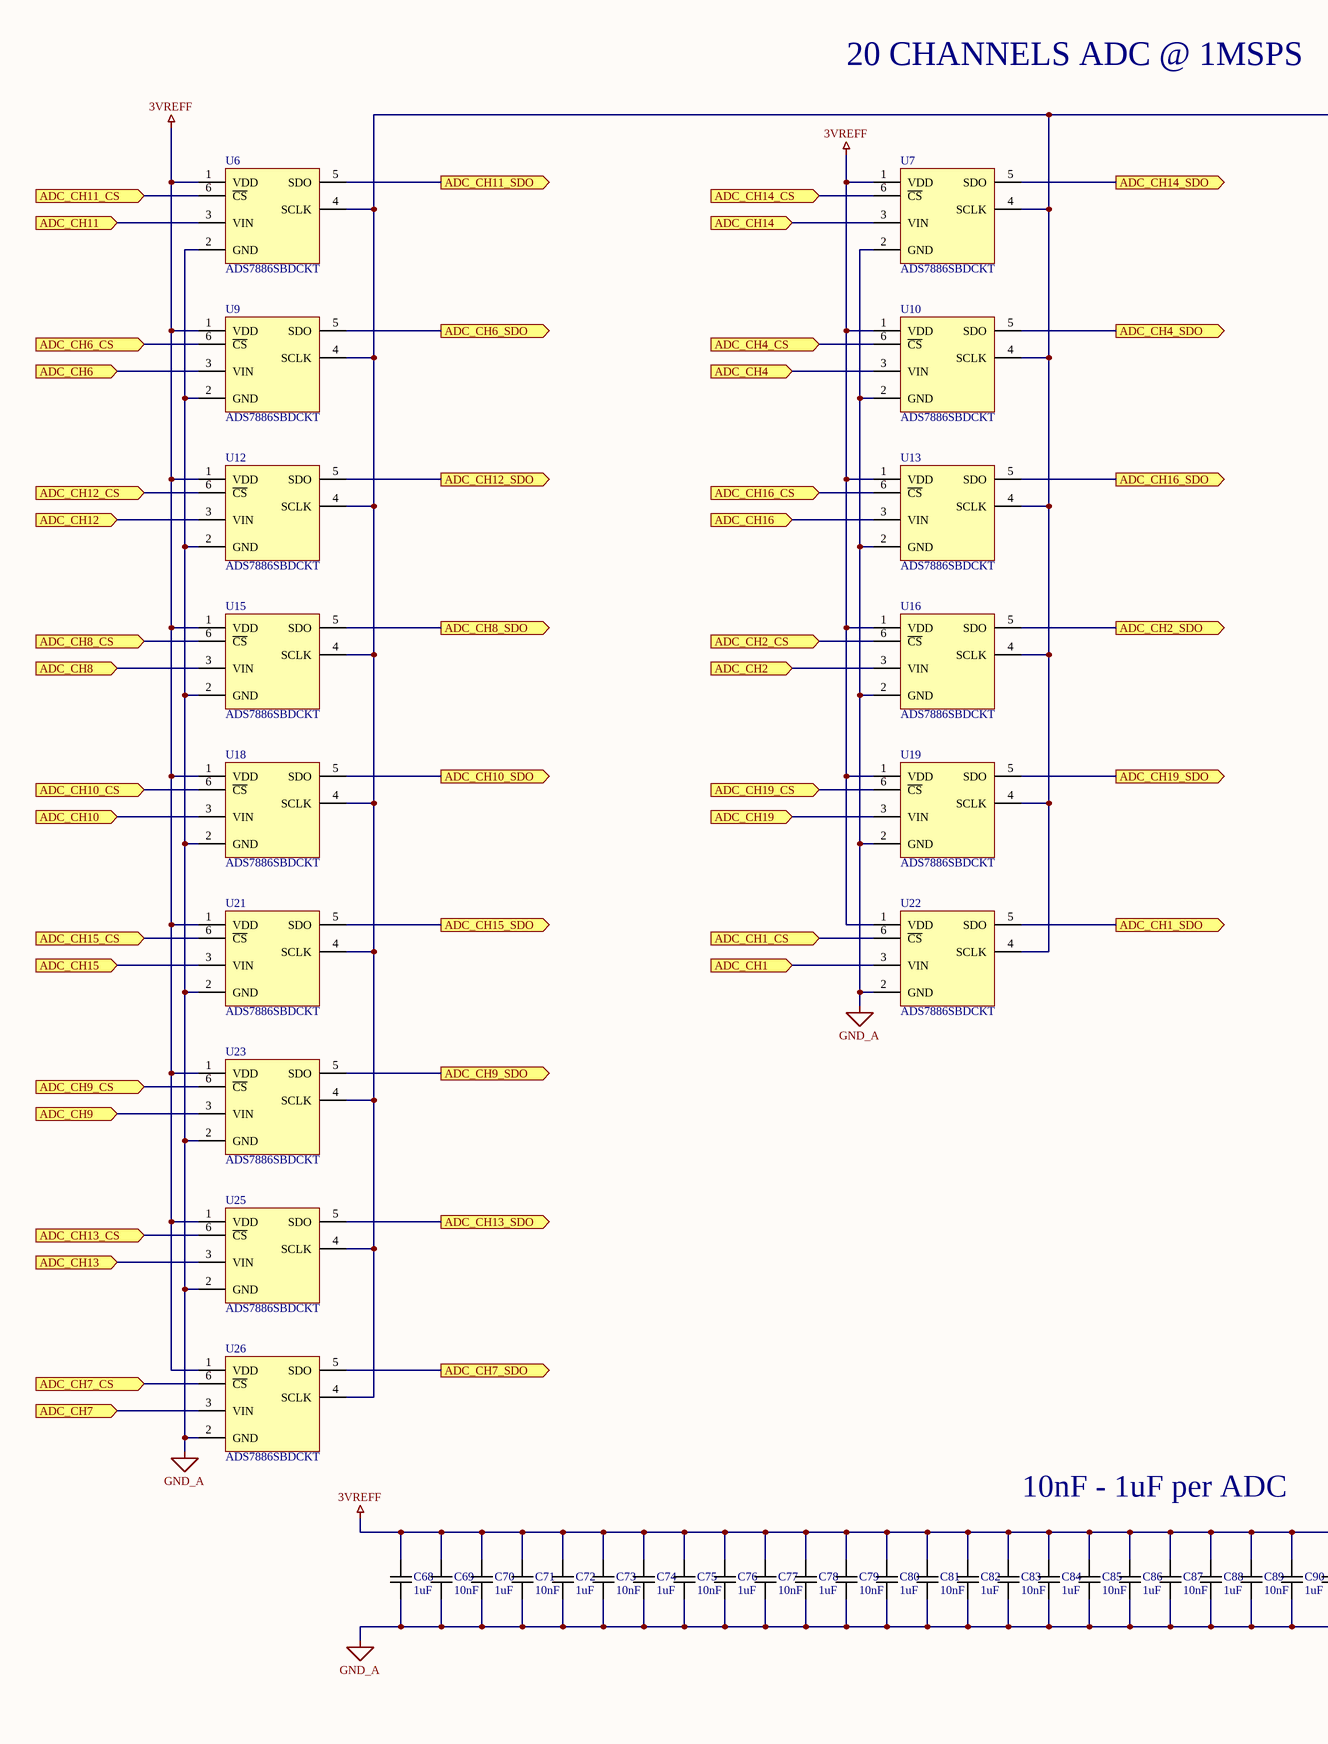
[diagram p4: AD_3_V1_01.SchDoc, left]
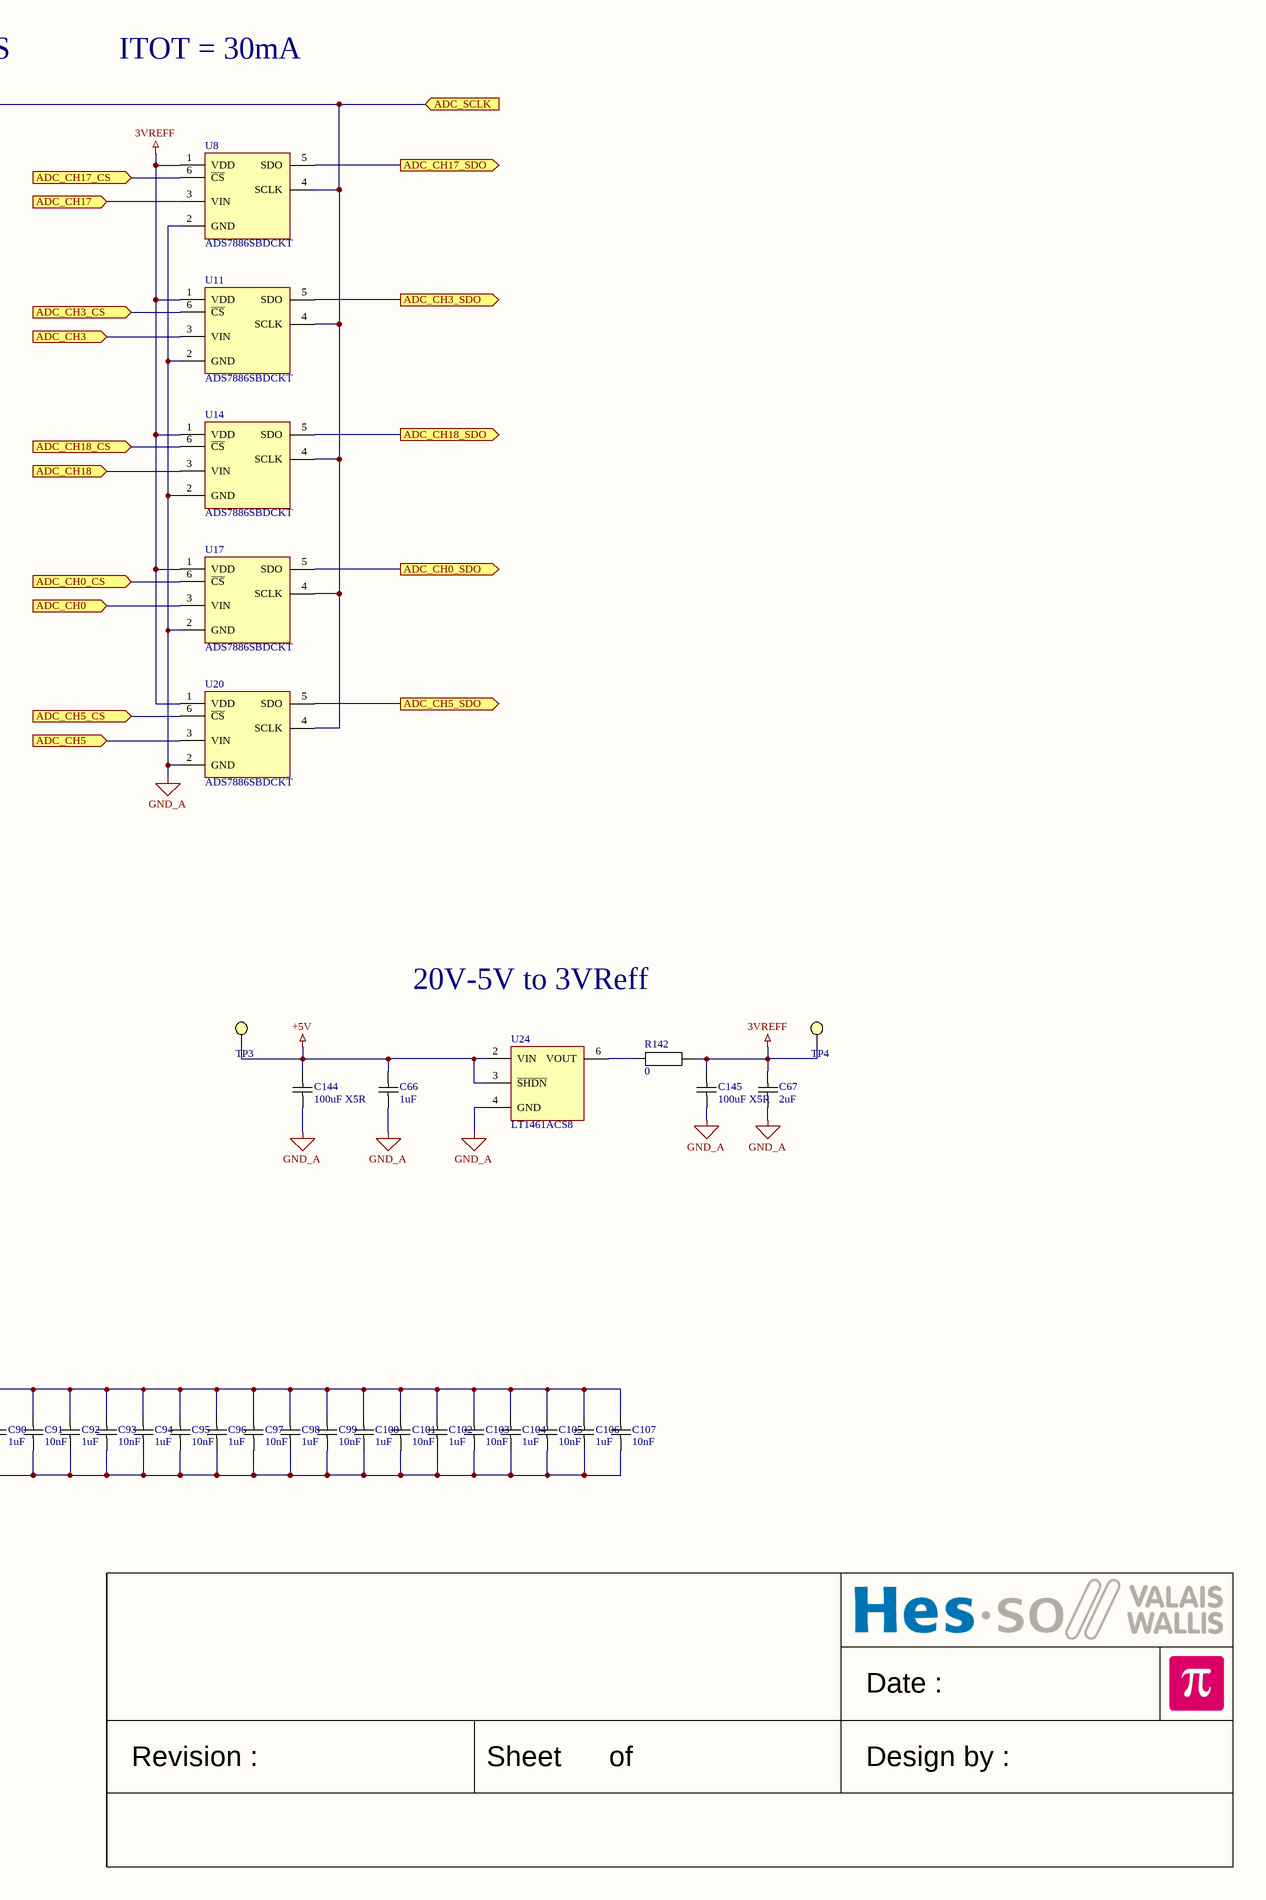
[diagram p5: AD_3_V1_01.SchDoc, right]

### Parts
C66  1uF  [CAPACITOR 1608 REFLOW]
C67  2uF  [CAPACITOR 1608 REFLOW]
C68  1uF  [CAPACITOR 1608 REFLOW]
C69  10nF  [CAPACITOR 1608 REFLOW]
C70  1uF  [CAPACITOR 1608 REFLOW]
C71  10nF  [CAPACITOR 1608 REFLOW]
C72  1uF  [CAPACITOR 1608 REFLOW]
C73  10nF  [CAPACITOR 1608 REFLOW]
C74  1uF  [CAPACITOR 1608 REFLOW]
C75  10nF  [CAPACITOR 1608 REFLOW]
C76  1uF  [CAPACITOR 1608 REFLOW]
C77  10nF  [CAPACITOR 1608 REFLOW]
C78  1uF  [CAPACITOR 1608 REFLOW]
C79  10nF  [CAPACITOR 1608 REFLOW]
C80  1uF  [CAPACITOR 1608 REFLOW]
C81  10nF  [CAPACITOR 1608 REFLOW]
C82  1uF  [CAPACITOR 1608 REFLOW]
C83  10nF  [CAPACITOR 1608 REFLOW]
C84  1uF  [CAPACITOR 1608 REFLOW]
C85  10nF  [CAPACITOR 1608 REFLOW]
C86  1uF  [CAPACITOR 1608 REFLOW]
C87  10nF  [CAPACITOR 1608 REFLOW]
C88  1uF  [CAPACITOR 1608 REFLOW]
C89  10nF  [CAPACITOR 1608 REFLOW]
C90  1uF  [CAPACITOR 1608 REFLOW]
C91  10nF  [CAPACITOR 1608 REFLOW]
C92  1uF  [CAPACITOR 1608 REFLOW]
C93  10nF  [CAPACITOR 1608 REFLOW]
C94  1uF  [CAPACITOR 1608 REFLOW]
C95  10nF  [CAPACITOR 1608 REFLOW]
C96  1uF  [CAPACITOR 1608 REFLOW]
C97  10nF  [CAPACITOR 1608 REFLOW]
C98  1uF  [CAPACITOR 1608 REFLOW]
C99  10nF  [CAPACITOR 1608 REFLOW]
C100  1uF  [CAPACITOR 1608 REFLOW]
C101  10nF  [CAPACITOR 1608 REFLOW]
C102  1uF  [CAPACITOR 1608 REFLOW]
C103  10nF  [CAPACITOR 1608 REFLOW]
C104  1uF  [CAPACITOR 1608 REFLOW]
C105  10nF  [CAPACITOR 1608 REFLOW]
C106  1uF  [CAPACITOR 1608 REFLOW]
C107  10nF  [CAPACITOR 1608 REFLOW]
C144  100uF X5R  [CAPACITOR 3216 REFLOW]
C145  100uF X5R  [CAPACITOR 3216 REFLOW]
R142  0  [RESISTOR 1608 REFLOW]
TP3  *  [Test Point Keystone Miniature RED]  (value not drawn)
TP4  *  [Test Point Keystone Miniature RED]  (value not drawn)
U6  ADS7886SBDCKT  [SOT23-6 P0.95 C1.5x3.0 H1.3]
U7  ADS7886SBDCKT  [SOT23-6 P0.95 C1.5x3.0 H1.3]
U8  ADS7886SBDCKT  [SOT23-6 P0.95 C1.5x3.0 H1.3]
U9  ADS7886SBDCKT  [SOT23-6 P0.95 C1.5x3.0 H1.3]
U10  ADS7886SBDCKT  [SOT23-6 P0.95 C1.5x3.0 H1.3]
U11  ADS7886SBDCKT  [SOT23-6 P0.95 C1.5x3.0 H1.3]
U12  ADS7886SBDCKT  [SOT23-6 P0.95 C1.5x3.0 H1.3]
U13  ADS7886SBDCKT  [SOT23-6 P0.95 C1.5x3.0 H1.3]
U14  ADS7886SBDCKT  [SOT23-6 P0.95 C1.5x3.0 H1.3]
U15  ADS7886SBDCKT  [SOT23-6 P0.95 C1.5x3.0 H1.3]
U16  ADS7886SBDCKT  [SOT23-6 P0.95 C1.5x3.0 H1.3]
U17  ADS7886SBDCKT  [SOT23-6 P0.95 C1.5x3.0 H1.3]
U18  ADS7886SBDCKT  [SOT23-6 P0.95 C1.5x3.0 H1.3]
U19  ADS7886SBDCKT  [SOT23-6 P0.95 C1.5x3.0 H1.3]
U20  ADS7886SBDCKT  [SOT23-6 P0.95 C1.5x3.0 H1.3]
U21  ADS7886SBDCKT  [SOT23-6 P0.95 C1.5x3.0 H1.3]
U22  ADS7886SBDCKT  [SOT23-6 P0.95 C1.5x3.0 H1.3]
U23  ADS7886SBDCKT  [SOT23-6 P0.95 C1.5x3.0 H1.3]
U24  LT1461ACS8  [SO8 P1.27 C4.0X5.0 H1.75]
U25  ADS7886SBDCKT  [SOT23-6 P0.95 C1.5x3.0 H1.3]
U26  ADS7886SBDCKT  [SOT23-6 P0.95 C1.5x3.0 H1.3]

### Ports
ADC_CH0 (in), ADC_CH0_CS (in), ADC_CH0_SDO (out), ADC_CH1 (in), ADC_CH1_CS (in), ADC_CH1_SDO (out), ADC_CH2 (in), ADC_CH2_CS (in), ADC_CH2_SDO (out), ADC_CH3 (in), ADC_CH3_CS (in), ADC_CH3_SDO (out), ADC_CH4 (in), ADC_CH4_CS (in), ADC_CH4_SDO (out), ADC_CH5 (in), ADC_CH5_CS (in), ADC_CH5_SDO (out), ADC_CH6 (in), ADC_CH6_CS (in), ADC_CH6_SDO (out), ADC_CH7 (in), ADC_CH7_CS (in), ADC_CH7_SDO (out), ADC_CH8 (in), ADC_CH8_CS (in), ADC_CH8_SDO (out), ADC_CH9 (in), ADC_CH9_CS (in), ADC_CH9_SDO (out), ADC_CH10 (in), ADC_CH10_CS (in), ADC_CH10_SDO (out), ADC_CH11 (in), ADC_CH11_CS (in), ADC_CH11_SDO (out), ADC_CH12 (in), ADC_CH12_CS (in), ADC_CH12_SDO (out), ADC_CH13 (in), ADC_CH13_CS (in), ADC_CH13_SDO (out), ADC_CH14 (in), ADC_CH14_CS (in), ADC_CH14_SDO (out), ADC_CH15 (in), ADC_CH15_CS (in), ADC_CH15_SDO (out), ADC_CH16 (in), ADC_CH16_CS (in), ADC_CH16_SDO (out), ADC_CH17 (in), ADC_CH17_CS (in), ADC_CH17_SDO (out), ADC_CH18 (in), ADC_CH18_CS (in), ADC_CH18_SDO (out), ADC_CH19 (in), ADC_CH19_CS (in), ADC_CH19_SDO (out), ADC_SCLK (in)

### Nets
3VREFF: C67.2 C68.2 C69.2 C70.2 C71.2 C72.2 C73.2 C74.2 C75.2 C76.2 C77.2 C78.2 C79.2 C80.2 C81.2 C82.2 C83.2 C84.2 C85.2 C86.2 C87.2 C88.2 C89.2 C90.2 C91.2 C92.2 C93.2 C94.2 C95.2 C96.2 C97.2 C98.2 C99.2 C100.2 C101.2 C102.2 C103.2 C104.2 C105.2 C106.2 C107.2 C145.2 R142.2 TP4.1 U6.1(VDD) U7.1(VDD) U8.1(VDD) U9.1(VDD) U10.1(VDD) U11.1(VDD) U12.1(VDD) U13.1(VDD) U14.1(VDD) U15.1(VDD) U16.1(VDD) U17.1(VDD) U18.1(VDD) U19.1(VDD) U20.1(VDD) U21.1(VDD) U22.1(VDD) U23.1(VDD) U25.1(VDD) U26.1(VDD)
+5V: C66.2 C144.2 TP3.1 U24.2(VIN) U24.3(~{SHDN})
GND_A: C66.1 C67.1 C68.1 C69.1 C70.1 C71.1 C72.1 C73.1 C74.1 C75.1 C76.1 C77.1 C78.1 C79.1 C80.1 C81.1 C82.1 C83.1 C84.1 C85.1 C86.1 C87.1 C88.1 C89.1 C90.1 C91.1 C92.1 C93.1 C94.1 C95.1 C96.1 C97.1 C98.1 C99.1 C100.1 C101.1 C102.1 C103.1 C104.1 C105.1 C106.1 C107.1 C144.1 C145.1 U6.2(GND) U7.2(GND) U8.2(GND) U9.2(GND) U10.2(GND) U11.2(GND) U12.2(GND) U13.2(GND) U14.2(GND) U15.2(GND) U16.2(GND) U17.2(GND) U18.2(GND) U19.2(GND) U20.2(GND) U21.2(GND) U22.2(GND) U23.2(GND) U24.4(GND) U25.2(GND) U26.2(GND)
ADC_CH0: U17.3(VIN) ; port ADC_CH0
ADC_CH0_CS: U17.6(~{CS}) ; port ADC_CH0_CS
ADC_CH0_SDO: U17.5(SDO) ; port ADC_CH0_SDO
ADC_CH1: U22.3(VIN) ; port ADC_CH1
ADC_CH1_CS: U22.6(~{CS}) ; port ADC_CH1_CS
ADC_CH1_SDO: U22.5(SDO) ; port ADC_CH1_SDO
ADC_CH2: U16.3(VIN) ; port ADC_CH2
ADC_CH2_CS: U16.6(~{CS}) ; port ADC_CH2_CS
ADC_CH2_SDO: U16.5(SDO) ; port ADC_CH2_SDO
ADC_CH3: U11.3(VIN) ; port ADC_CH3
ADC_CH3_CS: U11.6(~{CS}) ; port ADC_CH3_CS
ADC_CH3_SDO: U11.5(SDO) ; port ADC_CH3_SDO
ADC_CH4: U10.3(VIN) ; port ADC_CH4
ADC_CH4_CS: U10.6(~{CS}) ; port ADC_CH4_CS
ADC_CH4_SDO: U10.5(SDO) ; port ADC_CH4_SDO
ADC_CH5: U20.3(VIN) ; port ADC_CH5
ADC_CH5_CS: U20.6(~{CS}) ; port ADC_CH5_CS
ADC_CH5_SDO: U20.5(SDO) ; port ADC_CH5_SDO
ADC_CH6: U9.3(VIN) ; port ADC_CH6
ADC_CH6_CS: U9.6(~{CS}) ; port ADC_CH6_CS
ADC_CH6_SDO: U9.5(SDO) ; port ADC_CH6_SDO
ADC_CH7: U26.3(VIN) ; port ADC_CH7
ADC_CH7_CS: U26.6(~{CS}) ; port ADC_CH7_CS
ADC_CH7_SDO: U26.5(SDO) ; port ADC_CH7_SDO
ADC_CH8: U15.3(VIN) ; port ADC_CH8
ADC_CH8_CS: U15.6(~{CS}) ; port ADC_CH8_CS
ADC_CH8_SDO: U15.5(SDO) ; port ADC_CH8_SDO
ADC_CH9: U23.3(VIN) ; port ADC_CH9
ADC_CH9_CS: U23.6(~{CS}) ; port ADC_CH9_CS
ADC_CH9_SDO: U23.5(SDO) ; port ADC_CH9_SDO
ADC_CH10: U18.3(VIN) ; port ADC_CH10
ADC_CH10_CS: U18.6(~{CS}) ; port ADC_CH10_CS
ADC_CH10_SDO: U18.5(SDO) ; port ADC_CH10_SDO
ADC_CH11: U6.3(VIN) ; port ADC_CH11
ADC_CH11_CS: U6.6(~{CS}) ; port ADC_CH11_CS
ADC_CH11_SDO: U6.5(SDO) ; port ADC_CH11_SDO
ADC_CH12: U12.3(VIN) ; port ADC_CH12
ADC_CH12_CS: U12.6(~{CS}) ; port ADC_CH12_CS
ADC_CH12_SDO: U12.5(SDO) ; port ADC_CH12_SDO
ADC_CH13: U25.3(VIN) ; port ADC_CH13
ADC_CH13_CS: U25.6(~{CS}) ; port ADC_CH13_CS
ADC_CH13_SDO: U25.5(SDO) ; port ADC_CH13_SDO
ADC_CH14: U7.3(VIN) ; port ADC_CH14
ADC_CH14_CS: U7.6(~{CS}) ; port ADC_CH14_CS
ADC_CH14_SDO: U7.5(SDO) ; port ADC_CH14_SDO
ADC_CH15: U21.3(VIN) ; port ADC_CH15
ADC_CH15_CS: U21.6(~{CS}) ; port ADC_CH15_CS
ADC_CH15_SDO: U21.5(SDO) ; port ADC_CH15_SDO
ADC_CH16: U13.3(VIN) ; port ADC_CH16
ADC_CH16_CS: U13.6(~{CS}) ; port ADC_CH16_CS
ADC_CH16_SDO: U13.5(SDO) ; port ADC_CH16_SDO
ADC_CH17: U8.3(VIN) ; port ADC_CH17
ADC_CH17_CS: U8.6(~{CS}) ; port ADC_CH17_CS
ADC_CH17_SDO: U8.5(SDO) ; port ADC_CH17_SDO
ADC_CH18: U14.3(VIN) ; port ADC_CH18
ADC_CH18_CS: U14.6(~{CS}) ; port ADC_CH18_CS
ADC_CH18_SDO: U14.5(SDO) ; port ADC_CH18_SDO
ADC_CH19: U19.3(VIN) ; port ADC_CH19
ADC_CH19_CS: U19.6(~{CS}) ; port ADC_CH19_CS
ADC_CH19_SDO: U19.5(SDO) ; port ADC_CH19_SDO
ADC_SCLK: U6.4(SCLK) U7.4(SCLK) U8.4(SCLK) U9.4(SCLK) U10.4(SCLK) U11.4(SCLK) U12.4(SCLK) U13.4(SCLK) U14.4(SCLK) U15.4(SCLK) U16.4(SCLK) U17.4(SCLK) U18.4(SCLK) U19.4(SCLK) U20.4(SCLK) U21.4(SCLK) U22.4(SCLK) U23.4(SCLK) U25.4(SCLK) U26.4(SCLK) ; port ADC_SCLK
NetR142_1: R142.1 U24.6(VOUT)

### Notes on the sheet
- 20 CHANNELS ADC @ 1MSPS
- ITOT = 30mA
- 20V-5V to 3VReff
- 10nF - 1uF per ADC
- Date :
- Revision :
- Sheet
- of
- Design by :

### Library data of the parts
C66-C107 C144 C145 = Capacitor
  C66 C68 C70 C72 C74 C76 C78 C80 C82 C84 C86 C88 C90 C92 C94 C96 C98 C100 C102 C104 C106: Value: 1uF
  C67: Value: 2uF
  C69 C71 C73 C75 C77 C79 C81 C83 C85 C87 C89 C91 C93 C95 C97 C99 C101 C103 C105 C107: Value: 10nF
  C144 C145: Value: 100uF X5R
R142 = Resistor: Resistor 1% 50V 100mW 1608(0603); Value: 0
TP3 TP4 = Test Point: Value: *
U6-U23 U25 U26 = ADS7886SBDCKT: 12-Bit, 1-MSPS, Micro-Power, Miniature SAR Analog-to-Digital Converters; Value: ADS7886SBDCKT
U24 = LT1461ACS8: Micropower Precision Low Dropout Series Voltage Reference Family; Value: LT1461ACS8

## Sheet Connector_0_V1_01.SchDoc
size A2; Date: Date; CompanyName: HESSO; Engineer: Name; Address1: Route du Rawyl 47; Address2: 1950 Sion; Address3: Switzerland; DocumentNumber: 4; SheetNumber: 4; SheetTotal: 6; ProjectName: Project Name
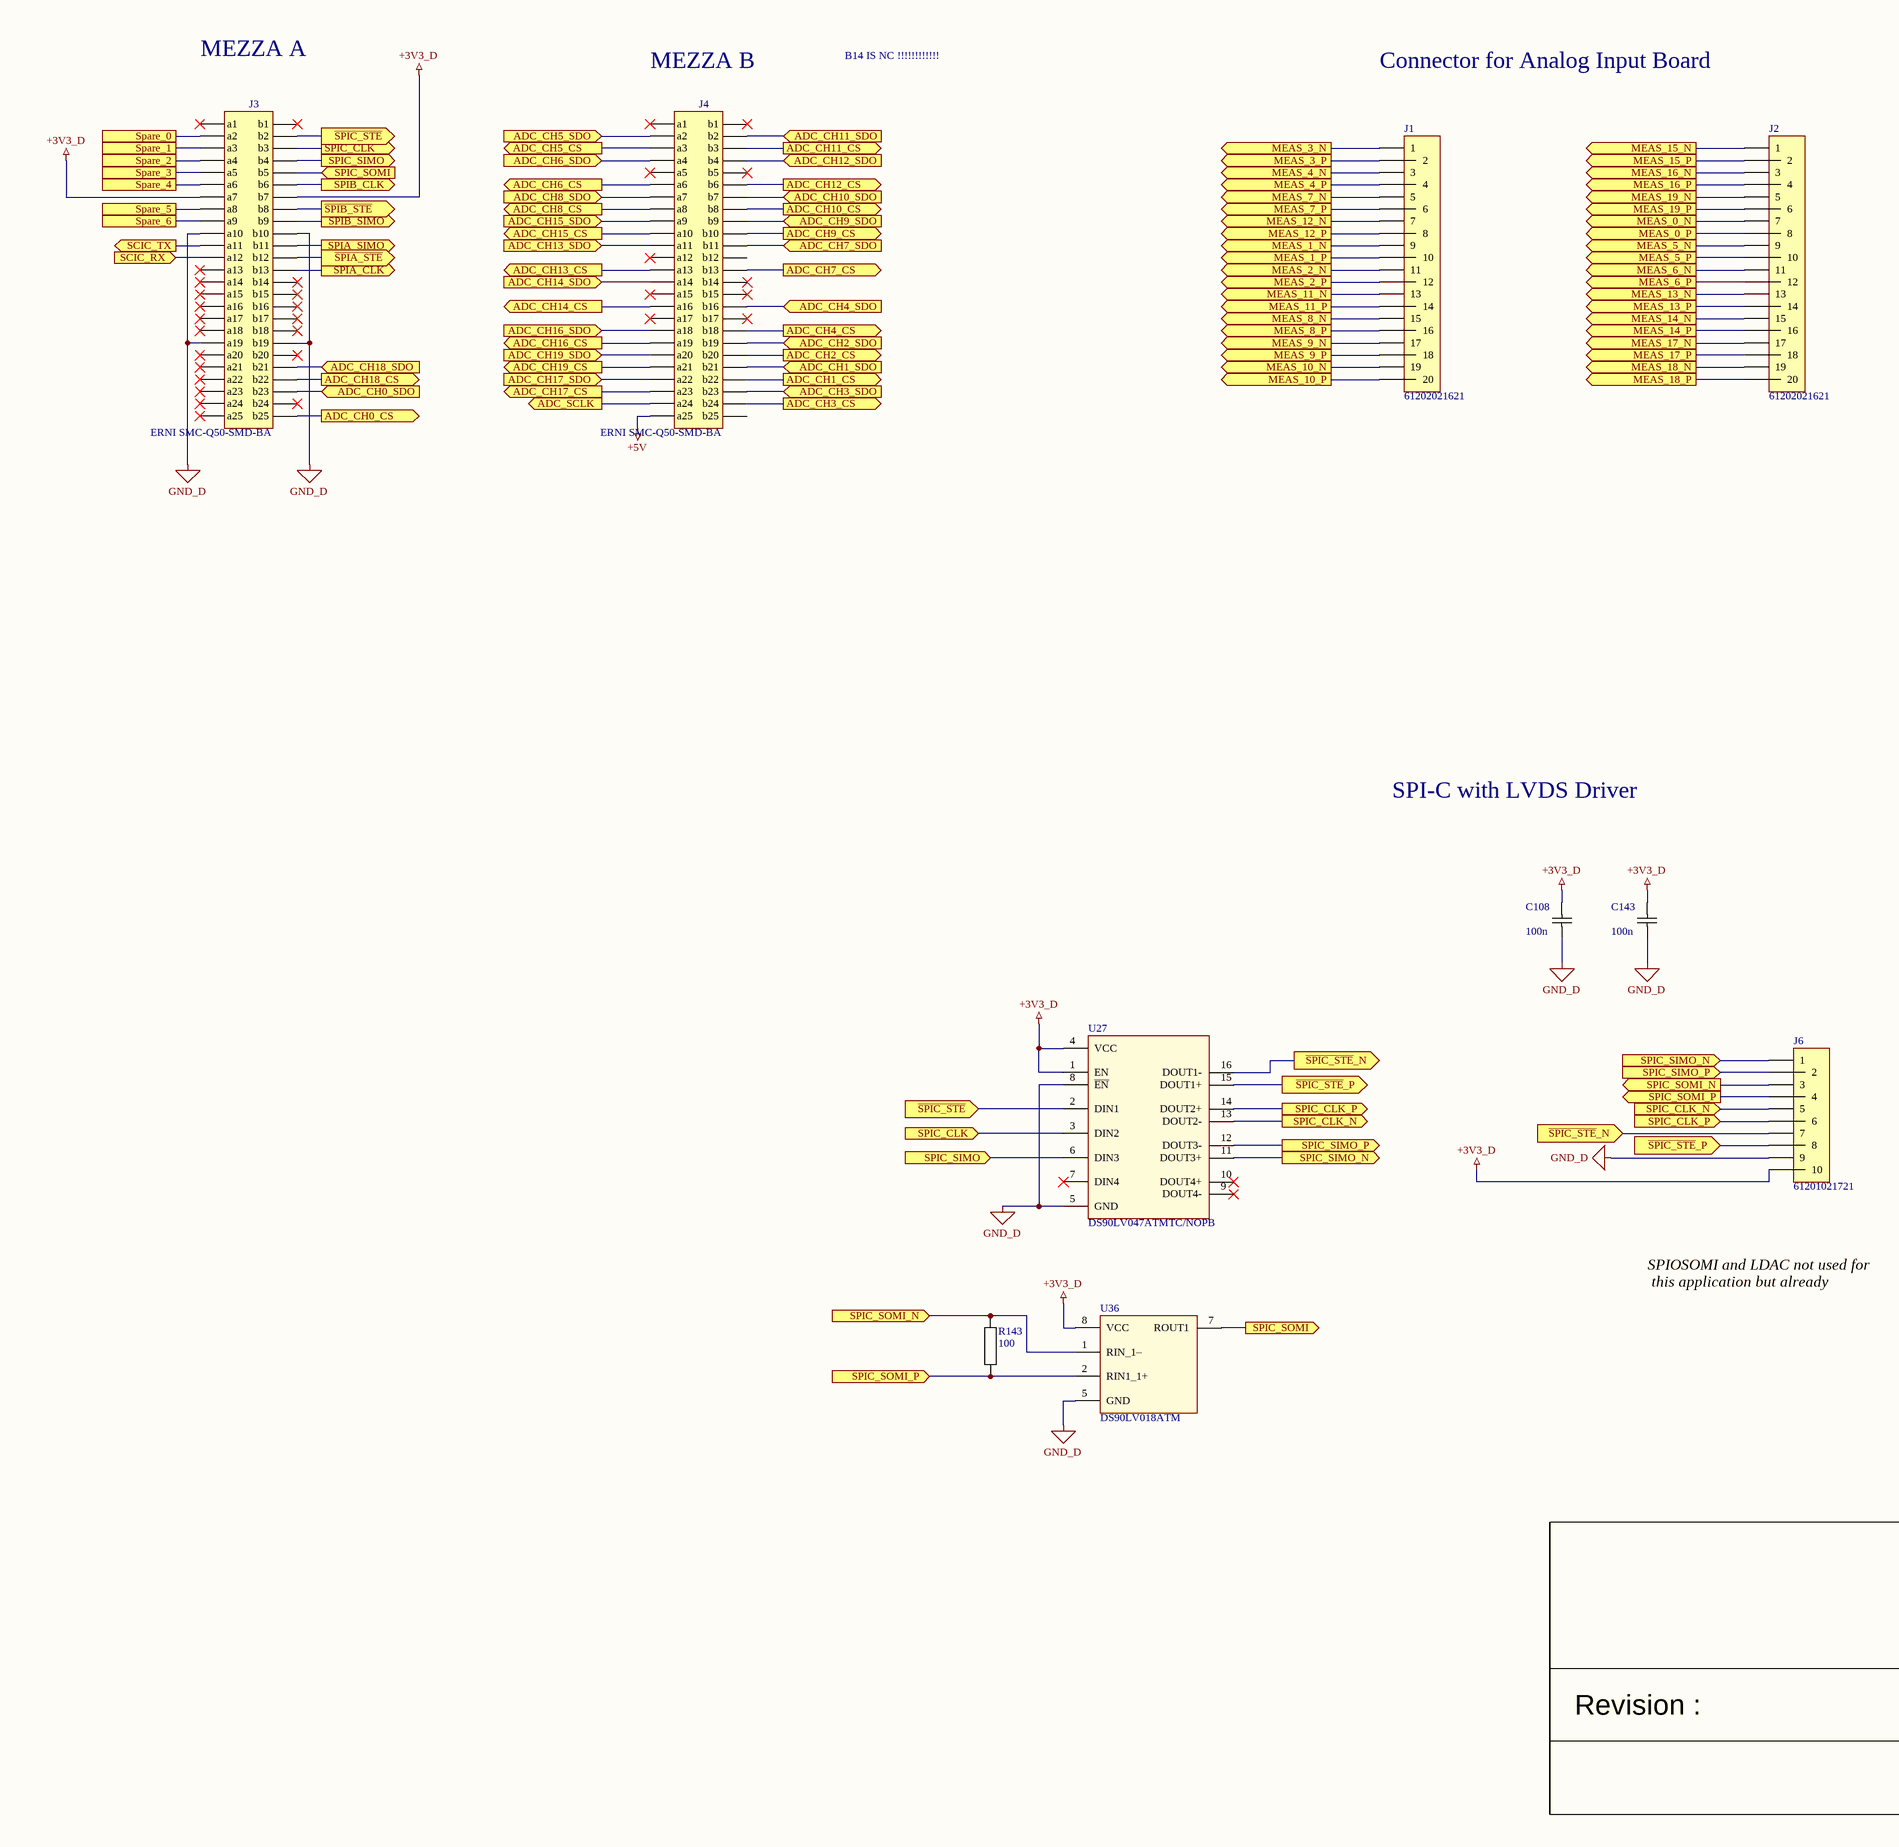
[diagram p6: Connector_0_V1_01.SchDoc, left]
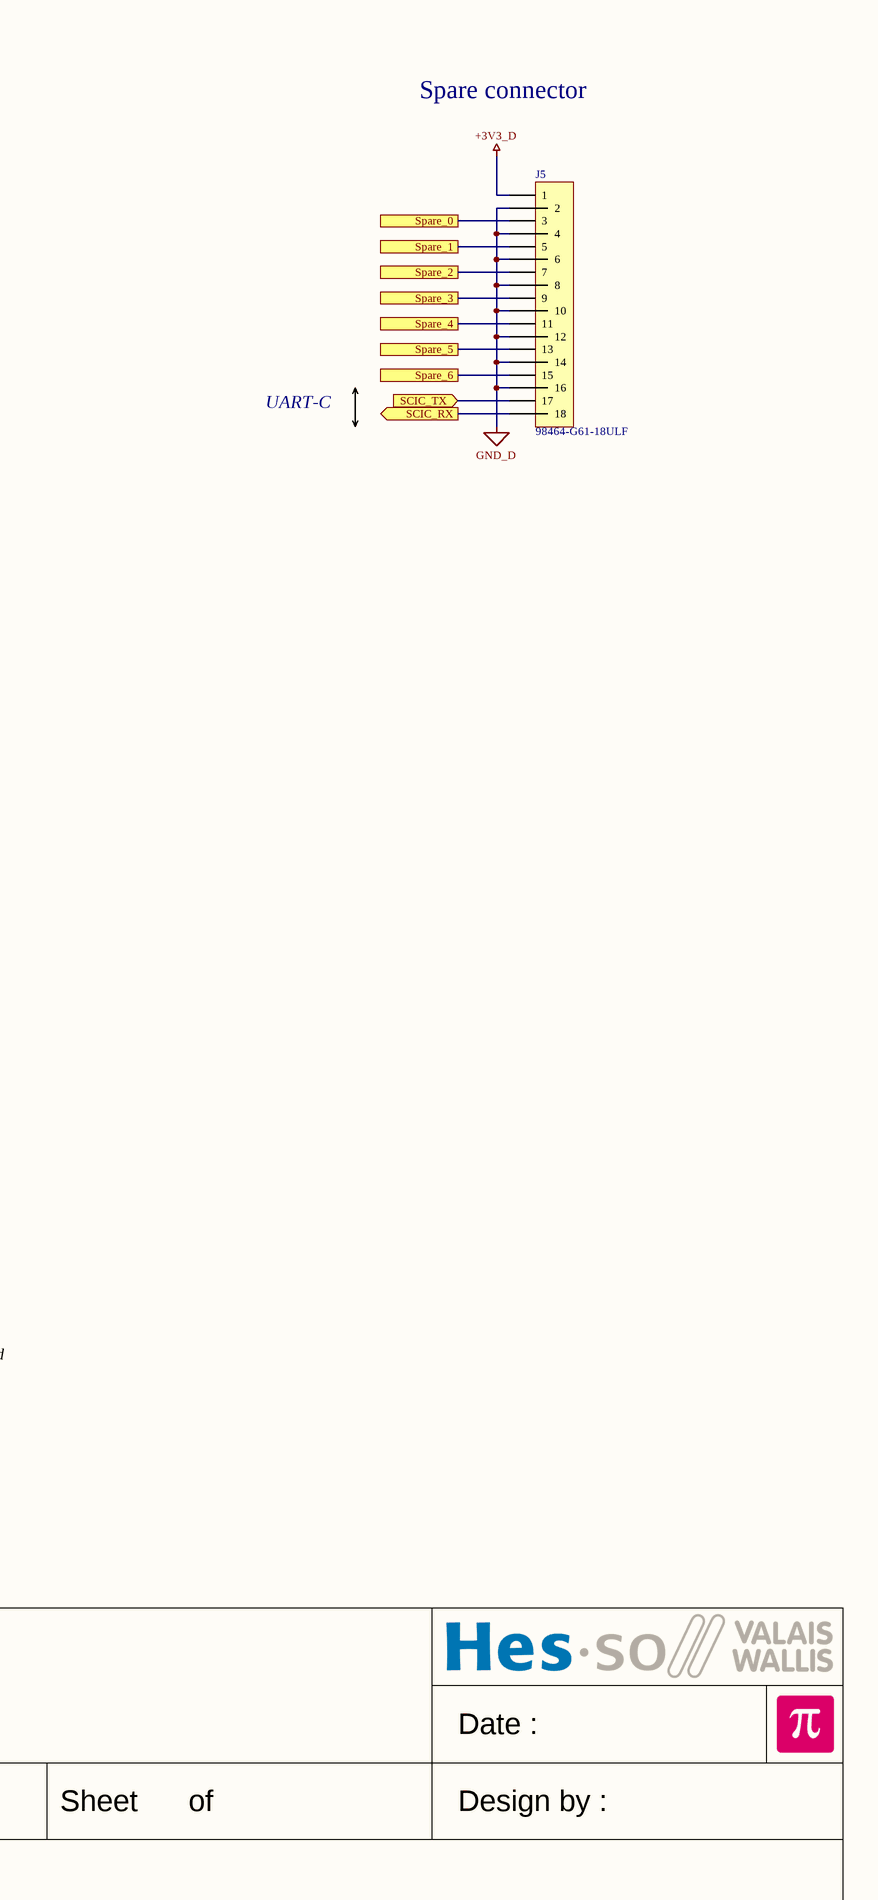
[diagram p7: Connector_0_V1_01.SchDoc, right]

### Parts
C108  100n  [CAPACITOR 2012 REFLOW]
C143  100n  [CAPACITOR 2012 REFLOW]
J1  61202021621  [FlatCable2x10 2.54MM RIGHT ANGLE TH]
J2  61202021621  [FlatCable2x10 2.54MM RIGHT ANGLE TH]
J3  ERNI SMC-Q50-SMD-BA  [ERNI SMC-Q50-SMD-BA]
J4  ERNI SMC-Q50-SMD-BA  [ERNI SMC-Q50-SMD-BA]
J5  98464-G61-18ULF  [FlatCable2x9 2MM Straight SMD FCI 98414-G52-18ALF]
J6  61201021721  [FlatCable2x5 2.54MM Straight TH]
R143  100  [RESISTOR 1608 REFLOW]
U27  DS90LV047ATMTC/NOPB  [TSSOP16 P0.65 C5.0x4.5 H1.1]
U36  DS90LV018ATM  [SO8 P1.27 C4.0X5.0 H1.75]

### Ports
ADC_CH0_CS (out), ADC_CH0_SDO (in), ADC_CH1_CS (out), ADC_CH1_SDO (in), ADC_CH2_CS (out), ADC_CH2_SDO (in), ADC_CH3_CS (out), ADC_CH3_SDO (in), ADC_CH4_CS (out), ADC_CH4_SDO (in), ADC_CH5_CS (out), ADC_CH5_SDO (in), ADC_CH6_CS (out), ADC_CH6_SDO (in), ADC_CH7_CS (out), ADC_CH7_SDO (in), ADC_CH8_CS (out), ADC_CH8_SDO (in), ADC_CH9_CS (out), ADC_CH9_SDO (in), ADC_CH10_CS (out), ADC_CH10_SDO (in), ADC_CH11_CS (out), ADC_CH11_SDO (in), ADC_CH12_CS (out), ADC_CH12_SDO (in), ADC_CH13_CS (out), ADC_CH13_SDO (in), ADC_CH14_CS (out), ADC_CH14_SDO (in), ADC_CH15_CS (out), ADC_CH15_SDO (in), ADC_CH16_CS (out), ADC_CH16_SDO (in), ADC_CH17_CS (out), ADC_CH17_SDO (in), ADC_CH18_CS (out), ADC_CH18_SDO (in), ADC_CH19_CS (out), ADC_CH19_SDO (in), ADC_SCLK (out), MEAS_0_N (out), MEAS_0_P (out), MEAS_1_N (out), MEAS_1_P (out), MEAS_2_N (out), MEAS_2_P (out), MEAS_3_N (out), MEAS_3_P (out), MEAS_4_N (out), MEAS_4_P (out), MEAS_5_N (out), MEAS_5_P (out), MEAS_6_N (out), MEAS_6_P (out), MEAS_7_N (out), MEAS_7_P (out), MEAS_8_N (out), MEAS_8_P (out), MEAS_9_N (out), MEAS_9_P (out), MEAS_10_N (out), MEAS_10_P (out), MEAS_11_N (out), MEAS_11_P (out), MEAS_12_N (out), MEAS_12_P (out), MEAS_13_N (out), MEAS_13_P (out), MEAS_14_N (out), MEAS_14_P (out), MEAS_15_N (out), MEAS_15_P (out), MEAS_16_N (out), MEAS_16_P (out), MEAS_17_N (out), MEAS_17_P (out), MEAS_18_N (out), MEAS_18_P (out), MEAS_19_N (out), MEAS_19_P (out), SCIC_RX (in), SCIC_RX (out), SCIC_TX (in), SCIC_TX (out), Spare_0, Spare_1, Spare_2, Spare_3, Spare_4, Spare_5, Spare_6, SPIA_CLK (out), SPIA_SIMO (out), SPIB_CLK (out), SPIB_SIMO (out), SPIC_CLK (in), SPIC_CLK (out), SPIC_CLK_N (in), SPIC_CLK_N (out), SPIC_CLK_P (in), SPIC_CLK_P (out), SPIC_SIMO (in), SPIC_SIMO (out), SPIC_SIMO_N (in), SPIC_SIMO_N (out), SPIC_SIMO_P (in), SPIC_SIMO_P (out), SPIC_SOMI (in), SPIC_SOMI (out), SPIC_SOMI_N (in), SPIC_SOMI_N (out), SPIC_SOMI_P (in), SPIC_SOMI_P (out), ~{SPIA_STE} (out), ~{SPIB_STE} (out), ~{SPIC_STE} (in), ~{SPIC_STE} (out), ~{SPIC_STE}_N (in), ~{SPIC_STE}_N (out), ~{SPIC_STE}_P (in), ~{SPIC_STE}_P (out)

### Nets
+3V3_D: C108.2 C143.2 J3.a7 J3.b7 J5.1 J6.10 U27.1(EN) U27.4(VCC) U36.8(VCC)
+5V: J4.a25
GND_D: C108.1 C143.1 J3.a10 J3.a19 J3.b10 J3.b19 J5.2 J5.4 J5.6 J5.8 J5.10 J5.12 J5.14 J5.16 J6.9 U27.5(GND) U27.8(~{EN}) U36.5(GND)
~{SPIA_STE}: J3.b12 ; port ~{SPIA_STE}
~{SPIB_STE}: J3.b8 ; port ~{SPIB_STE}
~{SPIC_STE}: J3.b2 U27.2(DIN1) ; port ~{SPIC_STE}
~{SPIC_STE}_N: J6.7 U27.16(DOUT1-) ; port ~{SPIC_STE}_N
~{SPIC_STE}_P: J6.8 U27.15(DOUT1+) ; port ~{SPIC_STE}_P
ADC_CH0_CS: J3.b25 ; port ADC_CH0_CS
ADC_CH0_SDO: J3.b23 ; port ADC_CH0_SDO
ADC_CH1_CS: J4.b22 ; port ADC_CH1_CS
ADC_CH1_SDO: J4.b21 ; port ADC_CH1_SDO
ADC_CH2_CS: J4.b20 ; port ADC_CH2_CS
ADC_CH2_SDO: J4.b19 ; port ADC_CH2_SDO
ADC_CH3_CS: J4.b24 ; port ADC_CH3_CS
ADC_CH3_SDO: J4.b23 ; port ADC_CH3_SDO
ADC_CH4_CS: J4.b18 ; port ADC_CH4_CS
ADC_CH4_SDO: J4.b16 ; port ADC_CH4_SDO
ADC_CH5_CS: J4.a3 ; port ADC_CH5_CS
ADC_CH5_SDO: J4.a2 ; port ADC_CH5_SDO
ADC_CH6_CS: J4.a6 ; port ADC_CH6_CS
ADC_CH6_SDO: J4.a4 ; port ADC_CH6_SDO
ADC_CH7_CS: J4.b13 ; port ADC_CH7_CS
ADC_CH7_SDO: J4.b11 ; port ADC_CH7_SDO
ADC_CH8_CS: J4.a8 ; port ADC_CH8_CS
ADC_CH8_SDO: J4.a7 ; port ADC_CH8_SDO
ADC_CH9_CS: J4.b10 ; port ADC_CH9_CS
ADC_CH9_SDO: J4.b9 ; port ADC_CH9_SDO
ADC_CH10_CS: J4.b8 ; port ADC_CH10_CS
ADC_CH10_SDO: J4.b7 ; port ADC_CH10_SDO
ADC_CH11_CS: J4.b3 ; port ADC_CH11_CS
ADC_CH11_SDO: J4.b2 ; port ADC_CH11_SDO
ADC_CH12_CS: J4.b6 ; port ADC_CH12_CS
ADC_CH12_SDO: J4.b4 ; port ADC_CH12_SDO
ADC_CH13_CS: J4.a13 ; port ADC_CH13_CS
ADC_CH13_SDO: J4.a11 ; port ADC_CH13_SDO
ADC_CH14_CS: J4.a16 ; port ADC_CH14_CS
ADC_CH14_SDO: J4.a14 ; port ADC_CH14_SDO
ADC_CH15_CS: J4.a10 ; port ADC_CH15_CS
ADC_CH15_SDO: J4.a9 ; port ADC_CH15_SDO
ADC_CH16_CS: J4.a19 ; port ADC_CH16_CS
ADC_CH16_SDO: J4.a18 ; port ADC_CH16_SDO
ADC_CH17_CS: J4.a23 ; port ADC_CH17_CS
ADC_CH17_SDO: J4.a22 ; port ADC_CH17_SDO
ADC_CH18_CS: J3.b22 ; port ADC_CH18_CS
ADC_CH18_SDO: J3.b21 ; port ADC_CH18_SDO
ADC_CH19_CS: J4.a21 ; port ADC_CH19_CS
ADC_CH19_SDO: J4.a20 ; port ADC_CH19_SDO
ADC_SCLK: J4.a24 ; port ADC_SCLK
MEAS_0_N: J2.7 ; port MEAS_0_N
MEAS_0_P: J2.8 ; port MEAS_0_P
MEAS_1_N: J1.9 ; port MEAS_1_N
MEAS_1_P: J1.10 ; port MEAS_1_P
MEAS_2_N: J1.11 ; port MEAS_2_N
MEAS_2_P: J1.12 ; port MEAS_2_P
MEAS_3_N: J1.1 ; port MEAS_3_N
MEAS_3_P: J1.2 ; port MEAS_3_P
MEAS_4_N: J1.3 ; port MEAS_4_N
MEAS_4_P: J1.4 ; port MEAS_4_P
MEAS_5_N: J2.9 ; port MEAS_5_N
MEAS_5_P: J2.10 ; port MEAS_5_P
MEAS_6_N: J2.11 ; port MEAS_6_N
MEAS_6_P: J2.12 ; port MEAS_6_P
MEAS_7_N: J1.5 ; port MEAS_7_N
MEAS_7_P: J1.6 ; port MEAS_7_P
MEAS_8_N: J1.15 ; port MEAS_8_N
MEAS_8_P: J1.16 ; port MEAS_8_P
MEAS_9_N: J1.17 ; port MEAS_9_N
MEAS_9_P: J1.18 ; port MEAS_9_P
MEAS_10_N: J1.19 ; port MEAS_10_N
MEAS_10_P: J1.20 ; port MEAS_10_P
MEAS_11_N: J1.13 ; port MEAS_11_N
MEAS_11_P: J1.14 ; port MEAS_11_P
MEAS_12_N: J1.7 ; port MEAS_12_N
MEAS_12_P: J1.8 ; port MEAS_12_P
MEAS_13_N: J2.13 ; port MEAS_13_N
MEAS_13_P: J2.14 ; port MEAS_13_P
MEAS_14_N: J2.15 ; port MEAS_14_N
MEAS_14_P: J2.16 ; port MEAS_14_P
MEAS_15_N: J2.1 ; port MEAS_15_N
MEAS_15_P: J2.2 ; port MEAS_15_P
MEAS_16_N: J2.3 ; port MEAS_16_N
MEAS_16_P: J2.4 ; port MEAS_16_P
MEAS_17_N: J2.17 ; port MEAS_17_N
MEAS_17_P: J2.18 ; port MEAS_17_P
MEAS_18_N: J2.19 ; port MEAS_18_N
MEAS_18_P: J2.20 ; port MEAS_18_P
MEAS_19_N: J2.5 ; port MEAS_19_N
MEAS_19_P: J2.6 ; port MEAS_19_P
SCIC_RX: J3.a12 J5.18 ; port SCIC_RX
SCIC_TX: J3.a11 J5.17 ; port SCIC_TX
Spare_0: J3.a2 J5.3 ; port Spare_0
Spare_1: J3.a3 J5.5 ; port Spare_1
Spare_2: J3.a4 J5.7 ; port Spare_2
Spare_3: J3.a5 J5.9 ; port Spare_3
Spare_4: J3.a6 J5.11 ; port Spare_4
Spare_5: J3.a8 J5.13 ; port Spare_5
Spare_6: J3.a9 J5.15 ; port Spare_6
SPIA_CLK: J3.b13 ; port SPIA_CLK
SPIA_SIMO: J3.b11 ; port SPIA_SIMO
SPIB_CLK: J3.b6 ; port SPIB_CLK
SPIB_SIMO: J3.b9 ; port SPIB_SIMO
SPIC_CLK: J3.b3 U27.3(DIN2) ; port SPIC_CLK
SPIC_CLK_N: J6.5 U27.13(DOUT2-) ; port SPIC_CLK_N
SPIC_CLK_P: J6.6 U27.14(DOUT2+) ; port SPIC_CLK_P
SPIC_SIMO: J3.b4 U27.6(DIN3) ; port SPIC_SIMO
SPIC_SIMO_N: J6.1 U27.11(DOUT3+) ; port SPIC_SIMO_N
SPIC_SIMO_P: J6.2 U27.12(DOUT3-) ; port SPIC_SIMO_P
SPIC_SOMI: J3.b5 U36.7(ROUT1) ; port SPIC_SOMI
SPIC_SOMI_N: J6.3 R143.1 U36.1(RIN_1–) ; port SPIC_SOMI_N
SPIC_SOMI_P: J6.4 R143.2 U36.2(RIN1_1+) ; port SPIC_SOMI_P

Not connected (* = marked no-connect by the designer): J3 a1* a13* a14* a15* a16* a17* a18* a20* a21* a22* a23* a24* a25* b1* b14* b15* b16* b17* b18* b20* b24*; J4 a1* a5* a12* a15* a17* b1* b5* b12 b14* b15* b17* b25; U27 7(DIN4)* 9(DOUT4-)* 10(DOUT4+)*

### Notes on the sheet
- MEZZA A
- MEZZA B
- B14 IS NC !!!!!!!!!!!!
- Connector for Analog Input Board
- Spare connector
- UART-C
- SPI-C with LVDS Driver
- SPIOSOMI and LDAC not used for
  this application but already reserved
- Date :
- Revision :
- Sheet
- of
- Design by :

### Library data of the parts
C108 C143 = Capacitor: Capacitor X7R 10% 50V 2012(0805); Value: 100n
J1 J2 = FlatCable2x10: Manufacturer: Wurth Elektronik; Mouser No.: 710-61202021621; Value: 61202021621
J3 J4 = ERNI SMC-Q50-SMD-BA: Male 1.27 pitch 2x25 pin connector
J5 = FlatCable2x9: Manufacturer: Amphenol FCI; Mouser No.: 649-98464-G61-18ULF; Value: 98464-G61-18ULF
J6 = FlatCable2x5: Manufacturer: Wurth Elektronik; Mouser No.: 710-61201021721; Value: 61201021721
R143 = Resistor: Resistor 1% 50V 100mW 1608(0603); Value: 100
U27 = DS90LV047A: DS90LV047A 3-V LVDS Quad CMOS Differential Line Driver; Manufacturer: Texas Instruments; Value: DS90LV047ATMTC/NOPB; Mouser No.: 926-DS90LV047ATMTCNO
U36 = DS90LV018ATM: 3-V LVDS single CMOS differential line receiver; Value: DS90LV018ATM

## Nets that join several sheets
+3V3_A: AD_0_V1_01 (6 pins), AD_1_V1_01 (C50.2 C53.2 U4.4 U5.4)
+5V: AD_3_V1_01 (5 pins), Connector_0_V1_01 (J4.a25)
GND_A: AD_0_V1_01 (54 pins), AD_1_V1_01 (36 pins), AD_3_V1_01 (65 pins)
ADC_CH0: AD_1_V1_01 (C62.2 R109.2 R113.2 R117.1), AD_3_V1_01 (U17.3)
ADC_CH0_CS: AD_3_V1_01 (U17.6), Connector_0_V1_01 (J3.b25)
ADC_CH0_SDO: AD_3_V1_01 (U17.5), Connector_0_V1_01 (J3.b23)
ADC_CH1: AD_0_V1_01 (C4.2 R1.2 R7.2 R13.1), AD_3_V1_01 (U22.3)
ADC_CH1_CS: AD_3_V1_01 (U22.6), Connector_0_V1_01 (J4.b22)
ADC_CH1_SDO: AD_3_V1_01 (U22.5), Connector_0_V1_01 (J4.b21)
ADC_CH2: AD_0_V1_01 (C13.2 R19.2 R25.2 R31.1), AD_3_V1_01 (U16.3)
ADC_CH2_CS: AD_3_V1_01 (U16.6), Connector_0_V1_01 (J4.b20)
ADC_CH2_SDO: AD_3_V1_01 (U16.5), Connector_0_V1_01 (J4.b19)
ADC_CH3: AD_0_V1_01 (C6.2 R3.2 R9.2 R15.1), AD_3_V1_01 (U11.3)
ADC_CH3_CS: AD_3_V1_01 (U11.6), Connector_0_V1_01 (J4.b24)
ADC_CH3_SDO: AD_3_V1_01 (U11.5), Connector_0_V1_01 (J4.b23)
ADC_CH4: AD_0_V1_01 (C15.2 R21.2 R27.2 R33.1), AD_3_V1_01 (U10.3)
ADC_CH4_CS: AD_3_V1_01 (U10.6), Connector_0_V1_01 (J4.b18)
ADC_CH4_SDO: AD_3_V1_01 (U10.5), Connector_0_V1_01 (J4.b16)
ADC_CH5: AD_0_V1_01 (C22.2 R37.2 R43.2 R49.1), AD_3_V1_01 (U20.3)
ADC_CH5_CS: AD_3_V1_01 (U20.6), Connector_0_V1_01 (J4.a3)
ADC_CH5_SDO: AD_3_V1_01 (U20.5), Connector_0_V1_01 (J4.a2)
ADC_CH6: AD_0_V1_01 (C31.2 R55.2 R61.2 R67.1), AD_3_V1_01 (U9.3)
ADC_CH6_CS: AD_3_V1_01 (U9.6), Connector_0_V1_01 (J4.a6)
ADC_CH6_SDO: AD_3_V1_01 (U9.5), Connector_0_V1_01 (J4.a4)
ADC_CH7: AD_0_V1_01 (C23.2 R38.2 R44.2 R50.1), AD_3_V1_01 (U26.3)
ADC_CH7_CS: AD_3_V1_01 (U26.6), Connector_0_V1_01 (J4.b13)
ADC_CH7_SDO: AD_3_V1_01 (U26.5), Connector_0_V1_01 (J4.b11)
ADC_CH8: AD_0_V1_01 (C33.2 R57.2 R63.2 R69.1), AD_3_V1_01 (U15.3)
ADC_CH8_CS: AD_3_V1_01 (U15.6), Connector_0_V1_01 (J4.a8)
ADC_CH8_SDO: AD_3_V1_01 (U15.5), Connector_0_V1_01 (J4.a7)
ADC_CH9: AD_0_V1_01 (C5.2 R2.2 R8.2 R14.1), AD_3_V1_01 (U23.3)
ADC_CH9_CS: AD_3_V1_01 (U23.6), Connector_0_V1_01 (J4.b10)
ADC_CH9_SDO: AD_3_V1_01 (U23.5), Connector_0_V1_01 (J4.b9)
ADC_CH10: AD_0_V1_01 (C14.2 R20.2 R26.2 R32.1), AD_3_V1_01 (U18.3)
ADC_CH10_CS: AD_3_V1_01 (U18.6), Connector_0_V1_01 (J4.b8)
ADC_CH10_SDO: AD_3_V1_01 (U18.5), Connector_0_V1_01 (J4.b7)
ADC_CH11: AD_0_V1_01 (C24.2 R39.2 R45.2 R51.1), AD_3_V1_01 (U6.3)
ADC_CH11_CS: AD_3_V1_01 (U6.6), Connector_0_V1_01 (J4.b3)
ADC_CH11_SDO: AD_3_V1_01 (U6.5), Connector_0_V1_01 (J4.b2)
ADC_CH12: AD_0_V1_01 (C32.2 R56.2 R62.2 R68.1), AD_3_V1_01 (U12.3)
ADC_CH12_CS: AD_3_V1_01 (U12.6), Connector_0_V1_01 (J4.b6)
ADC_CH12_SDO: AD_3_V1_01 (U12.5), Connector_0_V1_01 (J4.b4)
ADC_CH13: AD_1_V1_01 (C43.2 R74.2 R78.2 R82.1), AD_3_V1_01 (U25.3)
ADC_CH13_CS: AD_3_V1_01 (U25.6), Connector_0_V1_01 (J4.a13)
ADC_CH13_SDO: AD_3_V1_01 (U25.5), Connector_0_V1_01 (J4.a11)
ADC_CH14: AD_1_V1_01 (C49.2 R86.2 R90.2 R94.1), AD_3_V1_01 (U7.3)
ADC_CH14_CS: AD_3_V1_01 (U7.6), Connector_0_V1_01 (J4.a16)
ADC_CH14_SDO: AD_3_V1_01 (U7.5), Connector_0_V1_01 (J4.a14)
ADC_CH15: AD_1_V1_01 (C42.2 R73.2 R77.2 R81.1), AD_3_V1_01 (U21.3)
ADC_CH15_CS: AD_3_V1_01 (U21.6), Connector_0_V1_01 (J4.a10)
ADC_CH15_SDO: AD_3_V1_01 (U21.5), Connector_0_V1_01 (J4.a9)
ADC_CH16: AD_1_V1_01 (C48.2 R85.2 R89.2 R93.1), AD_3_V1_01 (U13.3)
ADC_CH16_CS: AD_3_V1_01 (U13.6), Connector_0_V1_01 (J4.a19)
ADC_CH16_SDO: AD_3_V1_01 (U13.5), Connector_0_V1_01 (J4.a18)
ADC_CH17: AD_1_V1_01 (C57.2 R98.2 R102.2 R106.1), AD_3_V1_01 (U8.3)
ADC_CH17_CS: AD_3_V1_01 (U8.6), Connector_0_V1_01 (J4.a23)
ADC_CH17_SDO: AD_3_V1_01 (U8.5), Connector_0_V1_01 (J4.a22)
ADC_CH18: AD_1_V1_01 (C63.2 R110.2 R114.2 R118.1), AD_3_V1_01 (U14.3)
ADC_CH18_CS: AD_3_V1_01 (U14.6), Connector_0_V1_01 (J3.b22)
ADC_CH18_SDO: AD_3_V1_01 (U14.5), Connector_0_V1_01 (J3.b21)
ADC_CH19: AD_1_V1_01 (C56.2 R97.2 R101.2 R105.1), AD_3_V1_01 (U19.3)
ADC_CH19_CS: AD_3_V1_01 (U19.6), Connector_0_V1_01 (J4.a21)
ADC_CH19_SDO: AD_3_V1_01 (U19.5), Connector_0_V1_01 (J4.a20)
ADC_SCLK: AD_3_V1_01 (20 pins), Connector_0_V1_01 (J4.a24)
MEAS_0_N: AD_1_V1_01 (R111.1), Connector_0_V1_01 (J2.7)
MEAS_0_P: AD_1_V1_01 (R115.1), Connector_0_V1_01 (J2.8)
MEAS_1_N: AD_0_V1_01 (R4.1), Connector_0_V1_01 (J1.9)
MEAS_1_P: AD_0_V1_01 (R10.1), Connector_0_V1_01 (J1.10)
MEAS_2_N: AD_0_V1_01 (R22.1), Connector_0_V1_01 (J1.11)
MEAS_2_P: AD_0_V1_01 (R28.1), Connector_0_V1_01 (J1.12)
MEAS_3_N: AD_0_V1_01 (R6.1), Connector_0_V1_01 (J1.1)
MEAS_3_P: AD_0_V1_01 (R12.1), Connector_0_V1_01 (J1.2)
MEAS_4_N: AD_0_V1_01 (R24.1), Connector_0_V1_01 (J1.3)
MEAS_4_P: AD_0_V1_01 (R30.1), Connector_0_V1_01 (J1.4)
MEAS_5_N: AD_0_V1_01 (R40.1), Connector_0_V1_01 (J2.9)
MEAS_5_P: AD_0_V1_01 (R46.1), Connector_0_V1_01 (J2.10)
MEAS_6_N: AD_0_V1_01 (R58.1), Connector_0_V1_01 (J2.11)
MEAS_6_P: AD_0_V1_01 (R64.1), Connector_0_V1_01 (J2.12)
MEAS_7_N: AD_0_V1_01 (R41.1), Connector_0_V1_01 (J1.5)
MEAS_7_P: AD_0_V1_01 (R47.1), Connector_0_V1_01 (J1.6)
MEAS_8_N: AD_0_V1_01 (R60.1), Connector_0_V1_01 (J1.15)
MEAS_8_P: AD_0_V1_01 (R66.1), Connector_0_V1_01 (J1.16)
MEAS_9_N: AD_0_V1_01 (R5.1), Connector_0_V1_01 (J1.17)
MEAS_9_P: AD_0_V1_01 (R11.1), Connector_0_V1_01 (J1.18)
MEAS_10_N: AD_0_V1_01 (R23.1), Connector_0_V1_01 (J1.19)
MEAS_10_P: AD_0_V1_01 (R29.1), Connector_0_V1_01 (J1.20)
MEAS_11_N: AD_0_V1_01 (R42.1), Connector_0_V1_01 (J1.13)
MEAS_11_P: AD_0_V1_01 (R48.1), Connector_0_V1_01 (J1.14)
MEAS_12_N: AD_0_V1_01 (R59.1), Connector_0_V1_01 (J1.7)
MEAS_12_P: AD_0_V1_01 (R65.1), Connector_0_V1_01 (J1.8)
MEAS_13_N: AD_1_V1_01 (R76.1), Connector_0_V1_01 (J2.13)
MEAS_13_P: AD_1_V1_01 (R80.1), Connector_0_V1_01 (J2.14)
MEAS_14_N: AD_1_V1_01 (R88.1), Connector_0_V1_01 (J2.15)
MEAS_14_P: AD_1_V1_01 (R92.1), Connector_0_V1_01 (J2.16)
MEAS_15_N: AD_1_V1_01 (R75.1), Connector_0_V1_01 (J2.1)
MEAS_15_P: AD_1_V1_01 (R79.1), Connector_0_V1_01 (J2.2)
MEAS_16_N: AD_1_V1_01 (R87.1), Connector_0_V1_01 (J2.3)
MEAS_16_P: AD_1_V1_01 (R91.1), Connector_0_V1_01 (J2.4)
MEAS_17_N: AD_1_V1_01 (R100.1), Connector_0_V1_01 (J2.17)
MEAS_17_P: AD_1_V1_01 (R104.1), Connector_0_V1_01 (J2.18)
MEAS_18_N: AD_1_V1_01 (R112.1), Connector_0_V1_01 (J2.19)
MEAS_18_P: AD_1_V1_01 (R116.1), Connector_0_V1_01 (J2.20)
MEAS_19_N: AD_1_V1_01 (R99.1), Connector_0_V1_01 (J2.5)
MEAS_19_P: AD_1_V1_01 (R103.1), Connector_0_V1_01 (J2.6)
REF_1V5: AD_0_V1_01 (12 pins), AD_1_V1_01 (8 pins)